# Altium project Jetson_Xavier_NX_Carrier_Board_v1.1.PrjPcb
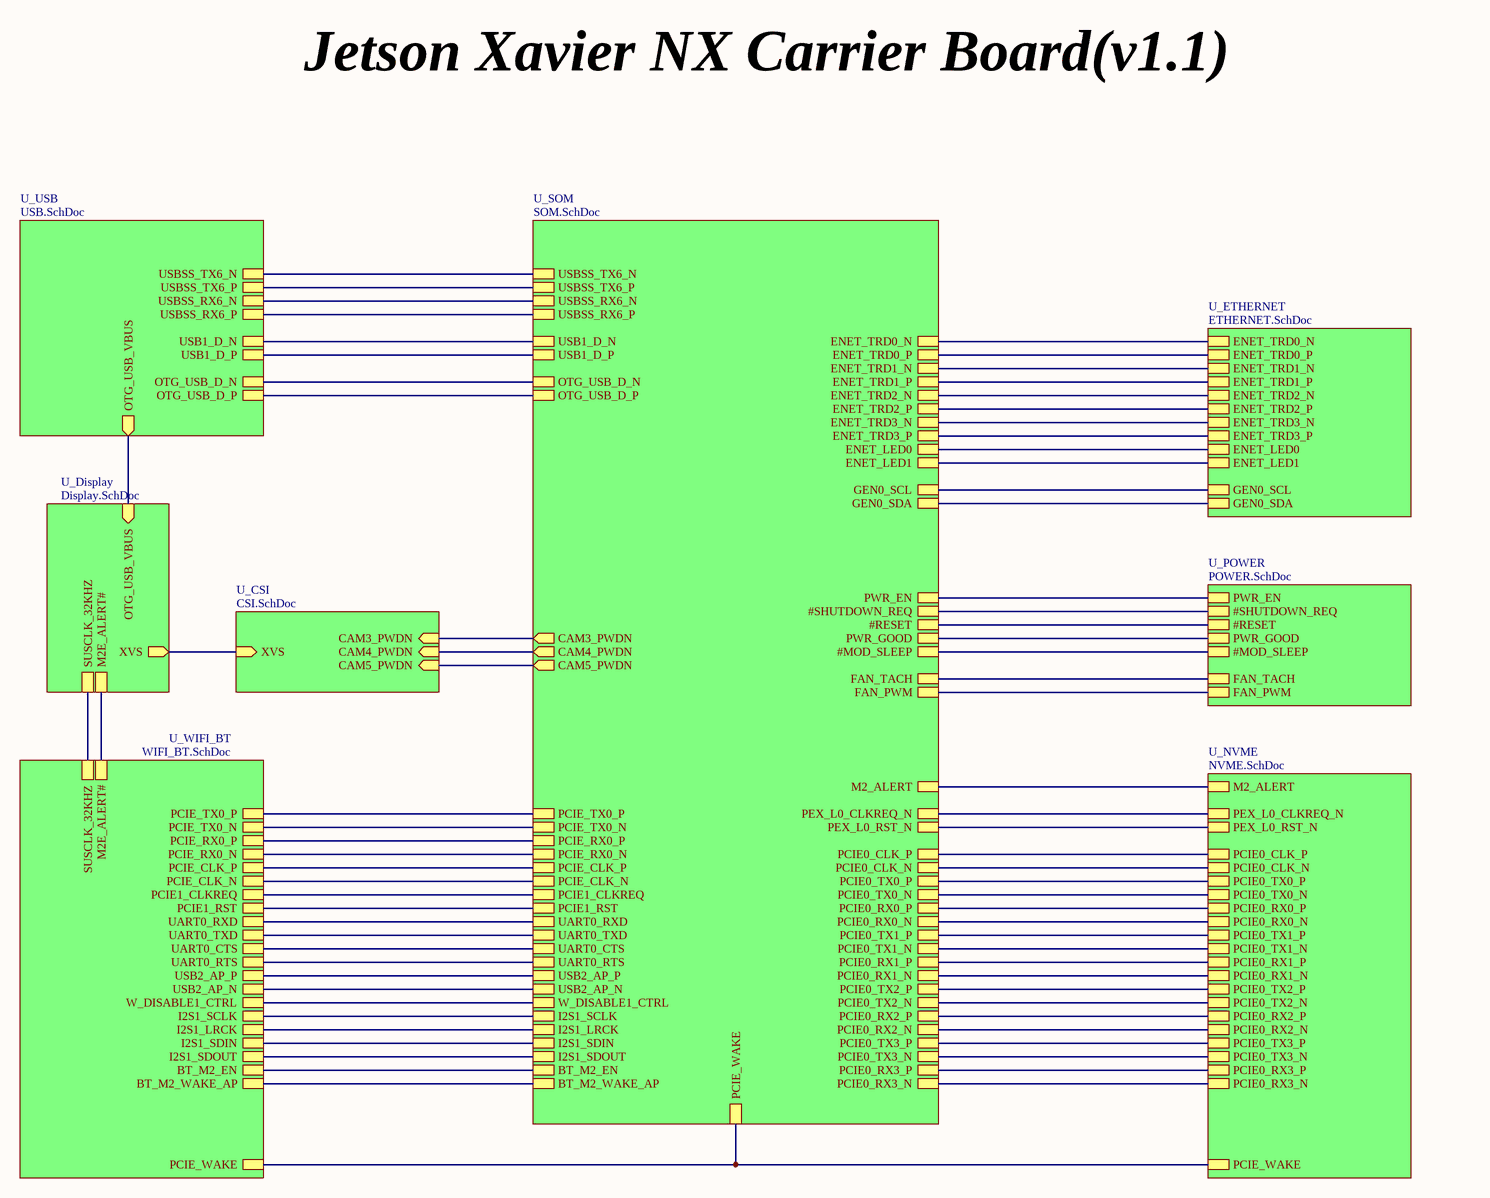
[diagram p0: Jetson_Xavier_NX_Carrier_Board_v1.1.SchDoc]
6 sheets, 156 parts. Net scope: hierarchical (ports join the sheet entries above them; power ports are global).
Board file: Xavier_NX_Carrier_Board_v1.1.PcbDoc
Sheets:
  Jetson_Xavier_NX_Carrier_Board_v1.1.SchDoc
    U_POWER = POWER.SchDoc
    U_SOM = SOM.SchDoc
    U_WIFI_BT = WIFI_BT.SchDoc
    U_NVME = NVME.SchDoc
    U_CSI = CSI.SchDoc

## Sheet Jetson_Xavier_NX_Carrier_Board_v1.1.SchDoc
size A3

### Sub-sheets
U_CSI = CSI.SchDoc: XVS (in), CAM3_PWDN (in), CAM4_PWDN (in), CAM5_PWDN (in)
U_Display = Display.SchDoc (file not in this document): OTG_USB_VBUS (in), M2E_ALERT#, SUSCLK_32KHZ, XVS (out)
U_ETHERNET = ETHERNET.SchDoc (file not in this document): ENET_LED1, ENET_TRD0_N, ENET_TRD0_P, ENET_TRD1_N, ENET_TRD1_P, ENET_TRD2_N, ENET_TRD2_P, ENET_TRD3_N, ENET_TRD3_P, ENET_LED0, GEN0_SCL, GEN0_SDA
U_NVME = NVME.SchDoc: PCIE_WAKE, PEX_L0_RST_N, PCIE0_CLK_P, PCIE0_CLK_N, PCIE0_TX0_P, PCIE0_TX0_N, PCIE0_RX0_P, PCIE0_RX0_N, PCIE0_TX1_P, PCIE0_TX1_N, PCIE0_RX1_P, PCIE0_RX1_N, PCIE0_TX2_P, PCIE0_TX2_N, PCIE0_RX2_P, PCIE0_RX2_N, PCIE0_TX3_P, PCIE0_TX3_N, PCIE0_RX3_P, PCIE0_RX3_N, PEX_L0_CLKREQ_N, M2_ALERT
U_POWER = POWER.SchDoc: PWR_EN, #SHUTDOWN_REQ, #RESET, PWR_GOOD, #MOD_SLEEP, FAN_TACH, FAN_PWM
U_SOM = SOM.SchDoc: PWR_EN, #SHUTDOWN_REQ, #RESET, PWR_GOOD, #MOD_SLEEP, GEN0_SCL, GEN0_SDA, PCIE_WAKE, PEX_L0_RST_N, PCIE0_CLK_P, PCIE0_CLK_N, PCIE0_TX0_P, PCIE0_TX0_N, PCIE0_RX0_P, PCIE0_RX0_N, PCIE0_TX1_P, PCIE0_TX1_N, PCIE0_RX1_P, PCIE0_RX1_N, PCIE0_TX2_P, PCIE0_TX2_N, PCIE0_RX2_P, PCIE0_RX2_N, PCIE0_TX3_P, PCIE0_TX3_N, PCIE0_RX3_P, PCIE0_RX3_N, USBSS_TX6_N, USBSS_TX6_P, USBSS_RX6_N, USBSS_RX6_P, ENET_TRD0_N, ENET_TRD0_P, ENET_TRD1_N, ENET_TRD1_P, ENET_TRD2_N, ENET_TRD2_P, ENET_TRD3_N, ENET_TRD3_P, ENET_LED1, ENET_LED0, PEX_L0_CLKREQ_N, M2_ALERT, PCIE1_RST, UART0_RTS, UART0_CTS, UART0_TXD, UART0_RXD, BT_M2_WAKE_AP, BT_M2_EN, W_DISABLE1_CTRL, USB2_AP_N, USB2_AP_P, USB1_D_P, USB1_D_N, OTG_USB_D_P, OTG_USB_D_N, PCIE1_CLKREQ, PCIE_CLK_N, PCIE_CLK_P, PCIE_RX0_N, PCIE_RX0_P, PCIE_TX0_N, PCIE_TX0_P, FAN_PWM, FAN_TACH, I2S1_SCLK, I2S1_LRCK, I2S1_SDIN, I2S1_SDOUT, CAM3_PWDN (out), CAM4_PWDN (out), CAM5_PWDN (out)
U_USB = USB.SchDoc (file not in this document): USBSS_TX6_N, USBSS_TX6_P, USBSS_RX6_N, USBSS_RX6_P, USB1_D_N, USB1_D_P, OTG_USB_VBUS (out), OTG_USB_D_N, OTG_USB_D_P
U_WIFI_BT = WIFI_BT.SchDoc: M2E_ALERT#, W_DISABLE1_CTRL, BT_M2_EN, SUSCLK_32KHZ, UART0_RTS, UART0_CTS, UART0_TXD, UART0_RXD, BT_M2_WAKE_AP, I2S1_SDOUT, I2S1_SDIN, I2S1_LRCK, I2S1_SCLK, USB2_AP_N, USB2_AP_P, PCIE_CLK_N, PCIE_CLK_P, PCIE_RX0_N, PCIE_RX0_P, PCIE_TX0_N, PCIE_TX0_P, PCIE_WAKE, PCIE1_CLKREQ, PCIE1_RST

### Nets
#MOD_SLEEP: sheet U_POWER/#MOD_SLEEP, sheet U_SOM/#MOD_SLEEP
#RESET: sheet U_POWER/#RESET, sheet U_SOM/#RESET
#SHUTDOWN_REQ: sheet U_POWER/#SHUTDOWN_REQ, sheet U_SOM/#SHUTDOWN_REQ
BT_M2_EN: sheet U_SOM/BT_M2_EN, sheet U_WIFI_BT/BT_M2_EN
BT_M2_WAKE_AP: sheet U_SOM/BT_M2_WAKE_AP, sheet U_WIFI_BT/BT_M2_WAKE_AP
CAM3_PWDN: sheet U_SOM/CAM3_PWDN, sheet U_CSI/CAM3_PWDN
CAM4_PWDN: sheet U_SOM/CAM4_PWDN, sheet U_CSI/CAM4_PWDN
CAM5_PWDN: sheet U_SOM/CAM5_PWDN, sheet U_CSI/CAM5_PWDN
ENET_LED0: sheet U_ETHERNET/ENET_LED0, sheet U_SOM/ENET_LED0
ENET_LED1: sheet U_ETHERNET/ENET_LED1, sheet U_SOM/ENET_LED1
ENET_TRD0_N: sheet U_ETHERNET/ENET_TRD0_N, sheet U_SOM/ENET_TRD0_N
ENET_TRD0_P: sheet U_ETHERNET/ENET_TRD0_P, sheet U_SOM/ENET_TRD0_P
ENET_TRD1_N: sheet U_ETHERNET/ENET_TRD1_N, sheet U_SOM/ENET_TRD1_N
ENET_TRD1_P: sheet U_ETHERNET/ENET_TRD1_P, sheet U_SOM/ENET_TRD1_P
ENET_TRD2_N: sheet U_ETHERNET/ENET_TRD2_N, sheet U_SOM/ENET_TRD2_N
ENET_TRD2_P: sheet U_ETHERNET/ENET_TRD2_P, sheet U_SOM/ENET_TRD2_P
ENET_TRD3_N: sheet U_ETHERNET/ENET_TRD3_N, sheet U_SOM/ENET_TRD3_N
ENET_TRD3_P: sheet U_ETHERNET/ENET_TRD3_P, sheet U_SOM/ENET_TRD3_P
FAN_PWM: sheet U_POWER/FAN_PWM, sheet U_SOM/FAN_PWM
FAN_TACH: sheet U_POWER/FAN_TACH, sheet U_SOM/FAN_TACH
GEN0_SCL: sheet U_ETHERNET/GEN0_SCL, sheet U_SOM/GEN0_SCL
GEN0_SDA: sheet U_ETHERNET/GEN0_SDA, sheet U_SOM/GEN0_SDA
I2S1_LRCK: sheet U_SOM/I2S1_LRCK, sheet U_WIFI_BT/I2S1_LRCK
I2S1_SCLK: sheet U_SOM/I2S1_SCLK, sheet U_WIFI_BT/I2S1_SCLK
I2S1_SDIN: sheet U_SOM/I2S1_SDIN, sheet U_WIFI_BT/I2S1_SDIN
I2S1_SDOUT: sheet U_SOM/I2S1_SDOUT, sheet U_WIFI_BT/I2S1_SDOUT
M2_ALERT: sheet U_SOM/M2_ALERT, sheet U_NVME/M2_ALERT
M2E_ALERT#: sheet U_Display/M2E_ALERT#, sheet U_WIFI_BT/M2E_ALERT#
OTG_USB_D_N: sheet U_SOM/OTG_USB_D_N, sheet U_USB/OTG_USB_D_N
OTG_USB_D_P: sheet U_SOM/OTG_USB_D_P, sheet U_USB/OTG_USB_D_P
PCIE0_CLK_N: sheet U_SOM/PCIE0_CLK_N, sheet U_NVME/PCIE0_CLK_N
PCIE0_CLK_P: sheet U_SOM/PCIE0_CLK_P, sheet U_NVME/PCIE0_CLK_P
PCIE0_RX0_N: sheet U_SOM/PCIE0_RX0_N, sheet U_NVME/PCIE0_RX0_N
PCIE0_RX0_P: sheet U_SOM/PCIE0_RX0_P, sheet U_NVME/PCIE0_RX0_P
PCIE0_RX1_N: sheet U_SOM/PCIE0_RX1_N, sheet U_NVME/PCIE0_RX1_N
PCIE0_RX1_P: sheet U_SOM/PCIE0_RX1_P, sheet U_NVME/PCIE0_RX1_P
PCIE0_RX2_N: sheet U_SOM/PCIE0_RX2_N, sheet U_NVME/PCIE0_RX2_N
PCIE0_RX2_P: sheet U_SOM/PCIE0_RX2_P, sheet U_NVME/PCIE0_RX2_P
PCIE0_RX3_N: sheet U_SOM/PCIE0_RX3_N, sheet U_NVME/PCIE0_RX3_N
PCIE0_RX3_P: sheet U_SOM/PCIE0_RX3_P, sheet U_NVME/PCIE0_RX3_P
PCIE0_TX0_N: sheet U_SOM/PCIE0_TX0_N, sheet U_NVME/PCIE0_TX0_N
PCIE0_TX0_P: sheet U_SOM/PCIE0_TX0_P, sheet U_NVME/PCIE0_TX0_P
PCIE0_TX1_N: sheet U_SOM/PCIE0_TX1_N, sheet U_NVME/PCIE0_TX1_N
PCIE0_TX1_P: sheet U_SOM/PCIE0_TX1_P, sheet U_NVME/PCIE0_TX1_P
PCIE0_TX2_N: sheet U_SOM/PCIE0_TX2_N, sheet U_NVME/PCIE0_TX2_N
PCIE0_TX2_P: sheet U_SOM/PCIE0_TX2_P, sheet U_NVME/PCIE0_TX2_P
PCIE0_TX3_N: sheet U_SOM/PCIE0_TX3_N, sheet U_NVME/PCIE0_TX3_N
PCIE0_TX3_P: sheet U_SOM/PCIE0_TX3_P, sheet U_NVME/PCIE0_TX3_P
PCIE1_CLKREQ: sheet U_SOM/PCIE1_CLKREQ, sheet U_WIFI_BT/PCIE1_CLKREQ
PCIE1_RST: sheet U_SOM/PCIE1_RST, sheet U_WIFI_BT/PCIE1_RST
PCIE_CLK_N: sheet U_SOM/PCIE_CLK_N, sheet U_WIFI_BT/PCIE_CLK_N
PCIE_CLK_P: sheet U_SOM/PCIE_CLK_P, sheet U_WIFI_BT/PCIE_CLK_P
PCIE_RX0_N: sheet U_SOM/PCIE_RX0_N, sheet U_WIFI_BT/PCIE_RX0_N
PCIE_RX0_P: sheet U_SOM/PCIE_RX0_P, sheet U_WIFI_BT/PCIE_RX0_P
PCIE_TX0_N: sheet U_SOM/PCIE_TX0_N, sheet U_WIFI_BT/PCIE_TX0_N
PCIE_TX0_P: sheet U_SOM/PCIE_TX0_P, sheet U_WIFI_BT/PCIE_TX0_P
PCIE_WAKE: sheet U_SOM/PCIE_WAKE, sheet U_WIFI_BT/PCIE_WAKE, sheet U_NVME/PCIE_WAKE
PEX_L0_CLKREQ_N: sheet U_SOM/PEX_L0_CLKREQ_N, sheet U_NVME/PEX_L0_CLKREQ_N
PEX_L0_RST_N: sheet U_SOM/PEX_L0_RST_N, sheet U_NVME/PEX_L0_RST_N
PWR_EN: sheet U_POWER/PWR_EN, sheet U_SOM/PWR_EN
PWR_GOOD: sheet U_POWER/PWR_GOOD, sheet U_SOM/PWR_GOOD
SUSCLK_32KHZ: sheet U_Display/SUSCLK_32KHZ, sheet U_WIFI_BT/SUSCLK_32KHZ
UART0_CTS: sheet U_SOM/UART0_CTS, sheet U_WIFI_BT/UART0_CTS
UART0_RTS: sheet U_SOM/UART0_RTS, sheet U_WIFI_BT/UART0_RTS
UART0_RXD: sheet U_SOM/UART0_RXD, sheet U_WIFI_BT/UART0_RXD
UART0_TXD: sheet U_SOM/UART0_TXD, sheet U_WIFI_BT/UART0_TXD
USB1_D_N: sheet U_SOM/USB1_D_N, sheet U_USB/USB1_D_N
USB1_D_P: sheet U_SOM/USB1_D_P, sheet U_USB/USB1_D_P
USB2_AP_N: sheet U_SOM/USB2_AP_N, sheet U_WIFI_BT/USB2_AP_N
USB2_AP_P: sheet U_SOM/USB2_AP_P, sheet U_WIFI_BT/USB2_AP_P
USBSS_RX6_N: sheet U_SOM/USBSS_RX6_N, sheet U_USB/USBSS_RX6_N
USBSS_RX6_P: sheet U_SOM/USBSS_RX6_P, sheet U_USB/USBSS_RX6_P
USBSS_TX6_N: sheet U_SOM/USBSS_TX6_N, sheet U_USB/USBSS_TX6_N
USBSS_TX6_P: sheet U_SOM/USBSS_TX6_P, sheet U_USB/USBSS_TX6_P
W_DISABLE1_CTRL: sheet U_SOM/W_DISABLE1_CTRL, sheet U_WIFI_BT/W_DISABLE1_CTRL
XVS: sheet U_Display/XVS, sheet U_CSI/XVS
(unnamed): sheet U_Display/OTG_USB_VBUS, sheet U_USB/OTG_USB_VBUS

### Notes on the sheet
- Jetson Xavier NX Carrier Board(v1.1)
- Title
- Size:
- Date:
- A3
- Number:
- Time:
- Revision:
- Sheet
- of
- Go360.io

## Sheet POWER.SchDoc
size A3
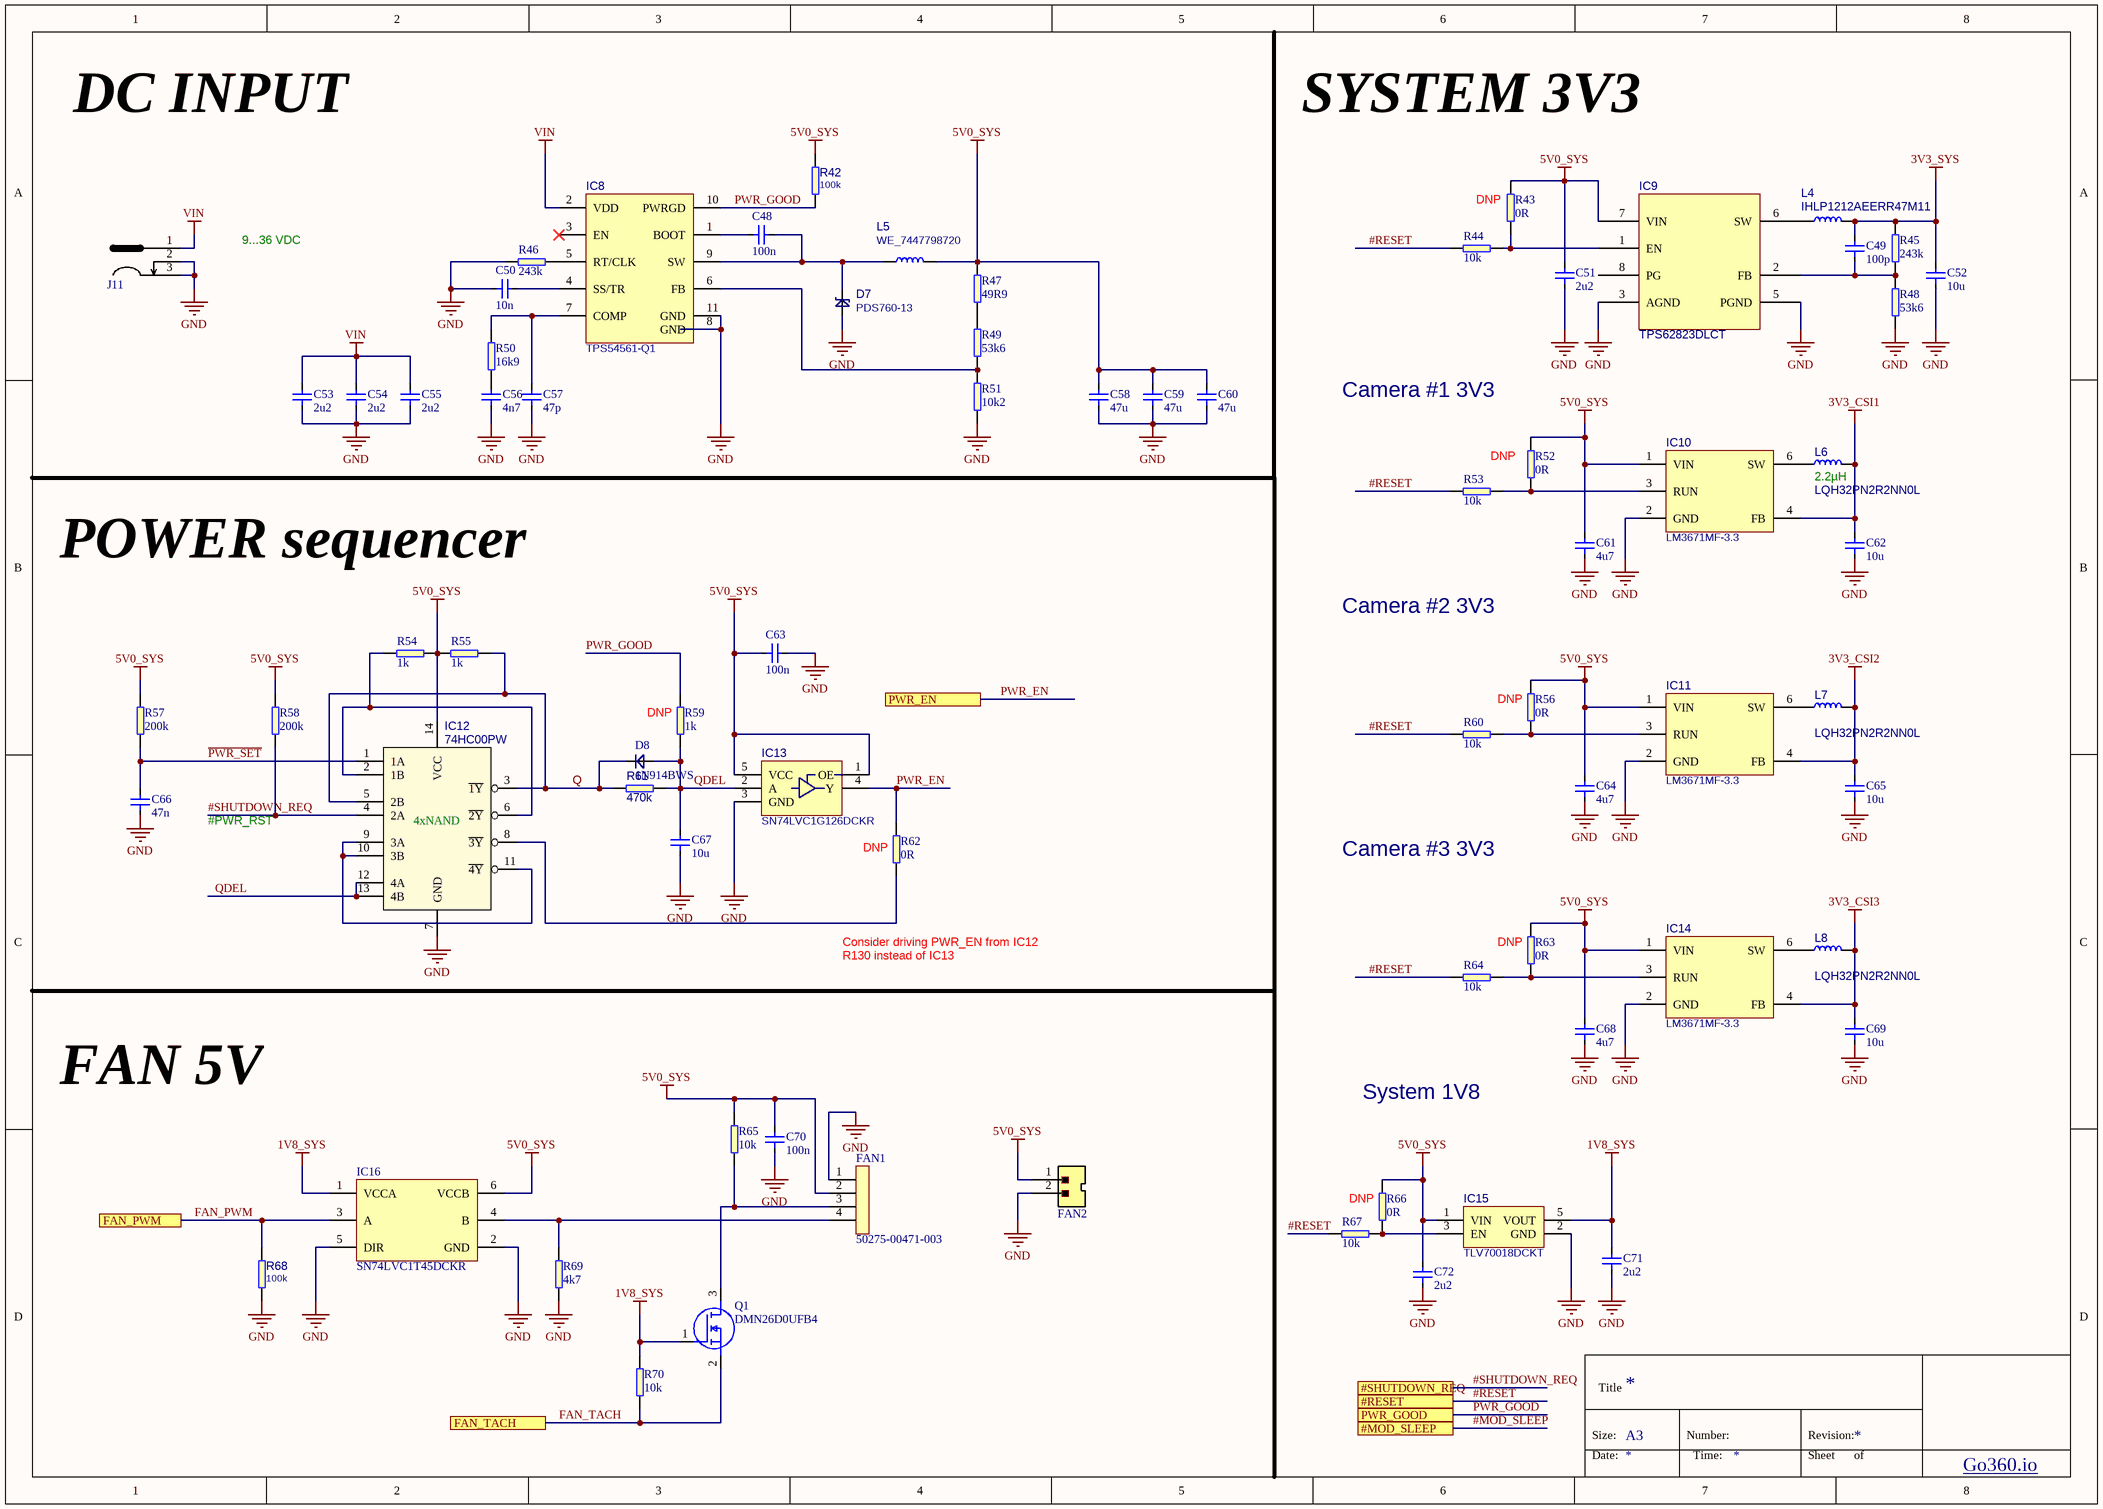
[diagram p1: POWER.SchDoc]

### Parts
C48  100n  [C0402]
C49  100p  [0805]
C50  10n  [C0402]
C51  2u2  [C0402]
C52  10u  [C0603]
C53  2u2  [1206]
C54  2u2  [1206]
C55  2u2  [1206]
C56  4n7  [C0402]
C57  47p  [C0402]
C58  47u  [0805]
C59  47u  [0805]
C60  47u  [0805]
C61  4u7  [C0402]
C62  10u  [C0603]
C63  100n  [C0402]
C64  4u7  [C0402]
C65  10u  [C0603]
C66  47n  [C0402]
C67  10u  [C0603]
C68  4u7  [C0402]
C69  10u  [C0603]
C70  100n  [C0402]
C71  2u2  [C0402]
C72  2u2  [C0402]
D7  PDS760-13  [PowerDI]
D8  1N914BWS  [SOD-323]
FAN1  50275-00471-003  [CON_MISC_004_TH_ST_M_P013_WTB]
FAN2  MX-22-23-2021  [molex_2223-2021]  (value not drawn)
IC8  TPS54561-Q1  [WSON-10_4x4]
IC9  TPS62823DLCT  [TPS62823]
IC10  LM3671MF-3.3  [SOT23-5N]
IC11  LM3671MF-3.3  [SOT23-5N]
IC12  74HC00PW  [TSSOP-14]
IC13  SN74LVC1G126DCKR  [R-PDSO-G5]
IC14  LM3671MF-3.3  [SOT23-5N]
IC15  TLV70018DCKT  [SC70-5]
IC16  SN74LVC1T45DCKR  [SC70_6]
J11  DC-005-5A-2.5  [DC_SOCKET]  (value not drawn)
L4  IHLP1212AEERR47M11  [IHLP-1212AE]
L5  WE_7447798720  [WE_7447798720]
L6  LQH32PN2R2NN0L  [LQH32PN2R2NN0L]
L7  LQH32PN2R2NN0L  [LQH32PN2R2NN0L]
L8  LQH32PN2R2NN0L  [LQH32PN2R2NN0L]
Q1  DMN26D0UFB4  [DMN26D0UFB47]
R42  100k  [R0402]
R43  0R  [R0402]
R44  10k  [R0402]
R45  243k  [R0402]
R46  243k  [R0402]
R47  49R9  [R0402]
R48  53k6  [R0402]
R49  53k6  [R0402]
R50  16k9  [R0402]
R51  10k2  [R0402]
R52  0R  [R0402]
R53  10k  [R0402]
R54  1k  [R0402]
R55  1k  [R0402]
R56  0R  [R0402]
R57  200k  [R0402]
R58  200k  [R0402]
R59  1k  [R0402]
R60  10k  [R0402]
R61  470k  [R0402]
R62  0R  [R0402]
R63  0R  [R0402]
R64  10k  [R0402]
R65  10k  [R0402]
R66  0R  [R0402]
R67  10k  [R0402]
R68  100k  [R0402]
R69  4k7  [R0402]
R70  10k  [R0402]

### Ports
#MOD_SLEEP, #RESET, #SHUTDOWN_REQ, FAN_PWM, FAN_TACH, PWR_EN, PWR_GOOD

### Nets
1V8_SYS: C71.2 IC15.5(VOUT) IC16.1(VCCA) Q1.1(G) R70.2
3V3_CSI1: C62.2 IC10.4(FB) L6.2
3V3_CSI2: C65.2 IC11.4(FB) L7.2
3V3_CSI3: C69.2 IC14.4(FB) L8.2
3V3_SYS: C49.2 C52.2 L4.2 R45.2
5V0_SYS: C51.2 C58.2 C59.2 C60.2 C61.2 C63.1 C64.2 C68.2 C70.2 C72.2 FAN1.2 FAN2.1 IC9.7(VIN) IC10.1(VIN) IC11.1(VIN) IC12.14(VCC) IC13.1(OE) IC13.5(VCC) IC14.1(VIN) IC15.1(VIN) IC16.6(VCCB) L5.2 R42.1 R43.2 R47.2 R52.2 R54.2 R55.1 R56.2 R57.2 R58.2 R63.2 R65.2 R66.2
GND: C50.1 C51.1 C52.1 C53.1 C54.1 C55.1 C56.1 C57.1 C58.1 C59.1 C60.1 C61.1 C62.1 C63.2 C64.1 C65.1 C66.1 C67.1 C68.1 C69.1 C70.1 C71.1 C72.1 D7.A FAN1.1 FAN2.2 IC8.8(GND) IC8.11(GND) IC9.3(AGND) IC9.5(PGND) IC10.2(GND) IC11.2(GND) IC12.7(GND) IC13.3(GND) IC14.2(GND) IC15.2(GND) IC16.2(GND) IC16.5(DIR) J11.2 J11.3 R46.1 R48.1 R51.1 R68.2 R69.1
VIN: C53.2 C54.2 C55.2 IC8.2(VDD) J11.1
#MOD_SLEEP: port #MOD_SLEEP
#RESET: R44.1 R53.1 R60.1 R64.1 R67.1 ; port #RESET
#SHUTDOWN_REQ: IC12.4(2A) R58.1 ; port #SHUTDOWN_REQ
~{PWR_SET}: C66.2 IC12.1(1A) R57.1
FAN_PWM: IC16.3(A) R68.1 ; port FAN_PWM
FAN_TACH: Q1.2(S) R70.1 ; port FAN_TACH
PWR_EN: IC13.4(Y) R62.2 ; port PWR_EN
PWR_GOOD: IC8.10(PWRGD) R42.2 R59.2 ; port PWR_GOOD
Q: D8.C IC12.3(~{1Y}) IC12.5(2B) R55.2 R61.1
QDEL: C67.2 D8.A IC12.12(4A) IC12.13(4B) IC13.2(A) R59.1 R61.2
NetC48_1: C48.1 IC8.1(BOOT)
NetC48_2: C48.2 D7.C IC8.9(SW) L5.1
NetC49_1: C49.1 IC9.2(FB) R45.1 R48.2
NetC50_2: C50.2 IC8.4(SS/TR)
NetC56_2: C56.2 R50.1
NetC57_2: C57.2 IC8.7(COMP) R50.2
NetFAN1_3: FAN1.3 Q1.3(D) R65.1
NetFAN1_4: FAN1.4 IC16.4(B) R69.2
NetIC8_5: IC8.5(RT/CLK) R46.2
NetIC8_6: IC8.6(FB) R49.1 R51.2
NetIC9_1: IC9.1(EN) R43.1 R44.2
NetIC9_6: IC9.6(SW) L4.1
NetIC10_3: IC10.3(RUN) R52.1 R53.2
NetIC10_6: IC10.6(SW) L6.1
NetIC11_3: IC11.3(RUN) R56.1 R60.2
NetIC11_6: IC11.6(SW) L7.1
NetIC12_2: IC12.2(1B) IC12.6(~{2Y}) R54.1
NetIC12_8: IC12.8(~{3Y}) R62.1
NetIC12_9: IC12.9(3A) IC12.10(3B) IC12.11(~{4Y})
NetIC14_3: IC14.3(RUN) R63.1 R64.2
NetIC14_6: IC14.6(SW) L8.1
NetIC15_3: IC15.3(EN) R66.1 R67.2
NetR47_1: R47.1 R49.2

Not connected (* = marked no-connect by the designer): IC8 3(EN)*; IC9 8(PG)

### Notes on the sheet
- DC INPUT
- SYSTEM 3V3
- 9...36 VDC
- (near R43) DNP
- Camera #1 3V3
- DNP
- (near L6) 2.2µH
- POWER sequencer
- Camera #2 3V3
- (near R59) DNP
- (near R56) DNP
- #PWR_RST
- (near R62) DNP
- Camera #3 3V3
- R130 instead of IC13
- Consider driving PWR_EN from IC12
- (near R63) DNP
- FAN 5V
- System 1V8
- Title
- Size:
- Date:
- A3
- Number:
- Time:
- Revision:
- Sheet
- of
- Go360.io
- (in symbol 74HC00PW) 4xNAND

### Library data of the parts
C48 C63 C70 = C_100n_0402: MLCC SMT Capacitor 100n 0402; Manufacturer: TDK; PartSymbol: C1005X5R0J104K050BA; PartNumber: C_100n_0402; Value: 100n
C49 = C_47u_0805: MLCC SMT Capacitor 100pF 0805; PartNumber: C_100p_0805; PartSymbol: 08051A101JAT2A; Value: 100p
C50 = C_10n_0402: MLCC SMT Capacitor 10 nF 0402; Manufacturer: AVX; PartSymbol: 04025G103ZAT2A; PartNumber: C_10n_0402; Value: 10n
C51 C71 C72 = C_2u2_0402: MLCC SMT Capacitor 2.2uF 0402; Manufacturer: TDK; PartSymbol: C1005X5R1A225K050BC; PartNumber: C_2u2_0402; Value: 2u2
C52 C62 C65 C67 C69 = C_10u_0603: MLCC SMT Capacitor 10uF 0603; Manufacturer: Walsin; PartSymbol: 0603X106M6R3CT; PartNumber: C_10u_0603; Value: 10u
C53-C55 = C_2u2_1206: MLCC SMT Capacitor 2.2uF 1206; Manufacturer: KEMET; PartSymbol: C1206C225J5RACTU; PartNumber: C_2u2_1206; Value: 2u2
C56 = C_4n7_0402: MLCC SMT Capacitor 4.7 nF 0402; Manufacturer: TDK; PartSymbol: CGA2B3X7S2A472K050BB; PartNumber: C_4n7_0402; Value: 4n7
C57 = C_47p_0402: MLCC SMT Capacitor 47pF 0402; Manufacturer: KEMET; PartSymbol: C0402C470J5GACTU; PartNumber: C_47p_0402; Value: 47p
C58-C60 = C_47u_0805: MLCC SMT Capacitor 47uF 0805; Manufacturer: KEMET; PartSymbol: C0805C476M9PACTU; PartNumber: C_47u_0805; Value: 47u
C61 C64 C68 = C_4u7_0402: MLCC SMT Capacitor 4.7uF 0402; Manufacturer: MURATA; PartSymbol: GRM155R60G475ME; PartNumber: C_4u7_0402; Value: 4u7
C66 = C_47n_0402: MLCC SMT Capacitor 47nF 0402; Manufacturer: MULTICOMP; PartSymbol: MC0402X473K160CT; PartNumber: C_47n_0402; Value: 47n
D7 = Diode Schottky: DIODE SCHOTTKY 60V 7A POWERDI5; Manufacturer: DIODES INC.; PartNumber: PDS760-13; Value: PDS760-13; PartSymbol: PDS760-13
D8 = diode: Diode small signal; Manufacturer: ON SEMICONDUCTOR; PartNumber: 1N914BWS; Value: 1N914BWS; PartSymbol: 1N914BWS
FAN2 = molex_2223-2021: Pinhead connector with key; Manufacturer: Molex; PartSymbol: 022232021 A-6373-02A222; Value: MX-22-23-2021; PartNumber: molex_2223-2021
IC8 = TPS54561: IC REG BCK SPLIT RAIL ADJ 10WSON; Manufacturer: TEXAS INSTRUMENTS; PartNumber: TPS54561-Q1; Value: TPS54561-Q1; PartSymbol: TPS54561-Q1
IC9 = TPS62823: IC REG BUCK ADJ 1A 8VSON-HR; Manufacturer: TEXAS INSTRUMENTS; PartNumber: TPS62823; Value: TPS62823DLCT; PartSymbol: TPS62823DLCT; Class: IC
IC10 IC11 IC14 = LM3671: DC/DC Buck Converter; Manufacturer: TEXAS INSTRUMENTS; PartSymbol: LM3671MF-3.3/NOPB; Value: LM3671MF-3.3; PartNumber: LM3671MF-3.3
IC12 = 74HC00PW: 2 NAND Gate, 4 channel; Manufacturer: NEXPERIA; PartNumber: 74HC00PW; Value: 74HC00PW; PartSymbol: 74HC00PW
IC13 = SN74LVC1G126: Buffer, tri-state; Manufacturer: Texas Instruments; PartNumber: SN74LVC1G126DCKR; Value: SN74LVC1G126DCKR; PartSymbol: SN74LVC1G126DCKR
IC15 = TLV700: Voltage Regulator, 2V to 5.5V, 175mV Dropout, 1.8Vout, 200mAout; Manufacturer: TEXAS INSTRUMENTS; Value: TLV70018DCKT; PartNumber: TLV70018DCKT; PartSymbol: TLV70018DCKT
J11 = DC_SOCKET: DC Power Connector, Jack, 4 A, 1.95 mm, PCB Mount, Through Hole; Manufacturer: XKB Connectivity; PartNumber: DC-005-5A-2.5; PartSymbol: DC-005-5A-2.5; Value: DC-005-5A-2.5
L4 = IHLP1212AEERR47M11: FIXED IND 470NH 6.7A 15 MOHM SMD; Manufacturer: VISHAY; Class: Inductance; PartNumber: IHLP1212AEERR47M11; Value: IHLP1212AEERR47M11; PartSymbol: IHLP1212AEERR47M11; Inductance: 470nH; RatedCurrent: 6.7A
L5 = WE_7447798720: Fixed Inductors WE-PDF 1064 7.2uH 7.9A 12.8mOhm; Manufacturer: WURTH ELEKTRONIK; PartNumber: WE_7447798720; Value: WE_7447798720; PartSymbol: 7447798720; Inductance: 7.2uH; RatedCurrent: 7.9A
L6-L8 = LQH32PN2R2NN0L: INDUCTOR, 2.2 ?H, ? 30%, 1212, 90 MHz, 0.073 ohm; Manufacturer: MURATA; Inductance: 2.2uH; PartNumber: LQH32PN2R2NN0L; Value: LQH32PN2R2NN0L; PartSymbol: LQH32PN2R2NN0L
Q1 = DMN26D0UFB4: MOSFET (N-Channel); Manufacturer_Name: Diodes Inc.; Manufacturer_Part_Number: DMN26D0UFB4-7; Datasheet Link: https://componentsearchengine.com/Datasheets/1/DMN26D0UFB4-7.pdf; Height: 0.4mm; Arrow Part Number: DMN26D0UFB4-7; Arrow Price/Stock: https://www.arrow.com/en/products/dmn26d0ufb4-7/diodes-incorporated; Mouser Part Number: 621-DMN26D0UFB4-7; Mouser Price/Stock: https://www.mouser.co.uk/ProductDetail/Diodes-Incorporated/DMN26D0UFB4-7?qs=GWgl%252BsiMZr%252B4pznsTuF3iQ%3D%3D
R42 R68 = R_100k_0402: SMT Resistor 100k 0402; Manufacturer: VISHAY; PartSymbol: CRCW0402100KFKEDHP; Tolerance: 1%; PartNumber: R_100k_0402; Value: 100k
R43 R52 R56 R62 R63 R66 = R_0R_0402: RES, 0R, 0402; Manufacturer: Panasonic; PartSymbol: ERJ2GE0R00X; PartNumber: R_0R_0402; Value: 0R
R44 R53 R60 R64 R65 R67 R70 = R_10k_0402: RES, 10k, 0402; Manufacturer: MULTICOMP; PartSymbol: MCMR04X1002FTL; PartNumber: R_10k_0402; Value: 10k
R45 R46 = R_243k_0402: RES, 243k, 0402; Manufacturer: MULTICOMP; PartSymbol: MCMR04X2433FTL; PartNumber: R_243k_0402; Value: 243k
R47 = R_49R9_0402: RES, 49R9, 0402; Manufacturer: VISHAY; PartSymbol: CRCW040249R9FKED; PartNumber: R_49R9_0402; Value: 49R9
R48 R49 = R_53k6_0402: RES, 53k6, 0402; Manufacturer: TE CONECTIVITY; PartSymbol: CPF0402B53K6E1; PartNumber: R_53k6_0402; Value: 53k6
R50 = R_16k9_0402: RES, 16k9, 0402; Manufacturer: Panasonic; PartSymbol: ERA2AEB1692X; PartNumber: R_16k9_0402; Value: 16k9
R51 = R_10k2_0402: RES, 10k2, 0402, 0.1%; PartNumber: R_10k2_0402_0.1%; Manufacturer: TE CONECTIVITY; PartSymbol: CPF0402B10K2E1; Tolerance: 0.1%; Value: 10k2
R54 R55 R59 = R_1k_0402: RES, 1k, 0402; Manufacturer: BOURNS; PartSymbol: CR0402-FX-1001GLF; PartNumber: R_1k_0402; Value: 1k
R57 R58 = R_200k_0402: RES, 200k, 0402; Manufacturer: YAGEO; PartSymbol: RC0402FR-07200KL; PartNumber: R_200k_0402; Value: 200k
R61 = R_470k_0402: SMT Resistor 470k 0402; Manufacturer: VISHAY; PartSymbol: CRCW0402470KFKED; PartNumber: R_470k_0402; Value: 470k
R69 = R_4k7_0402: RES, 4k7, 0402; Manufacturer: Panasonic; PartSymbol: ERJ2GEJ472X; PartNumber: R_4k7_0402; Value: 4k7

## Sheet SOM.SchDoc
size A3
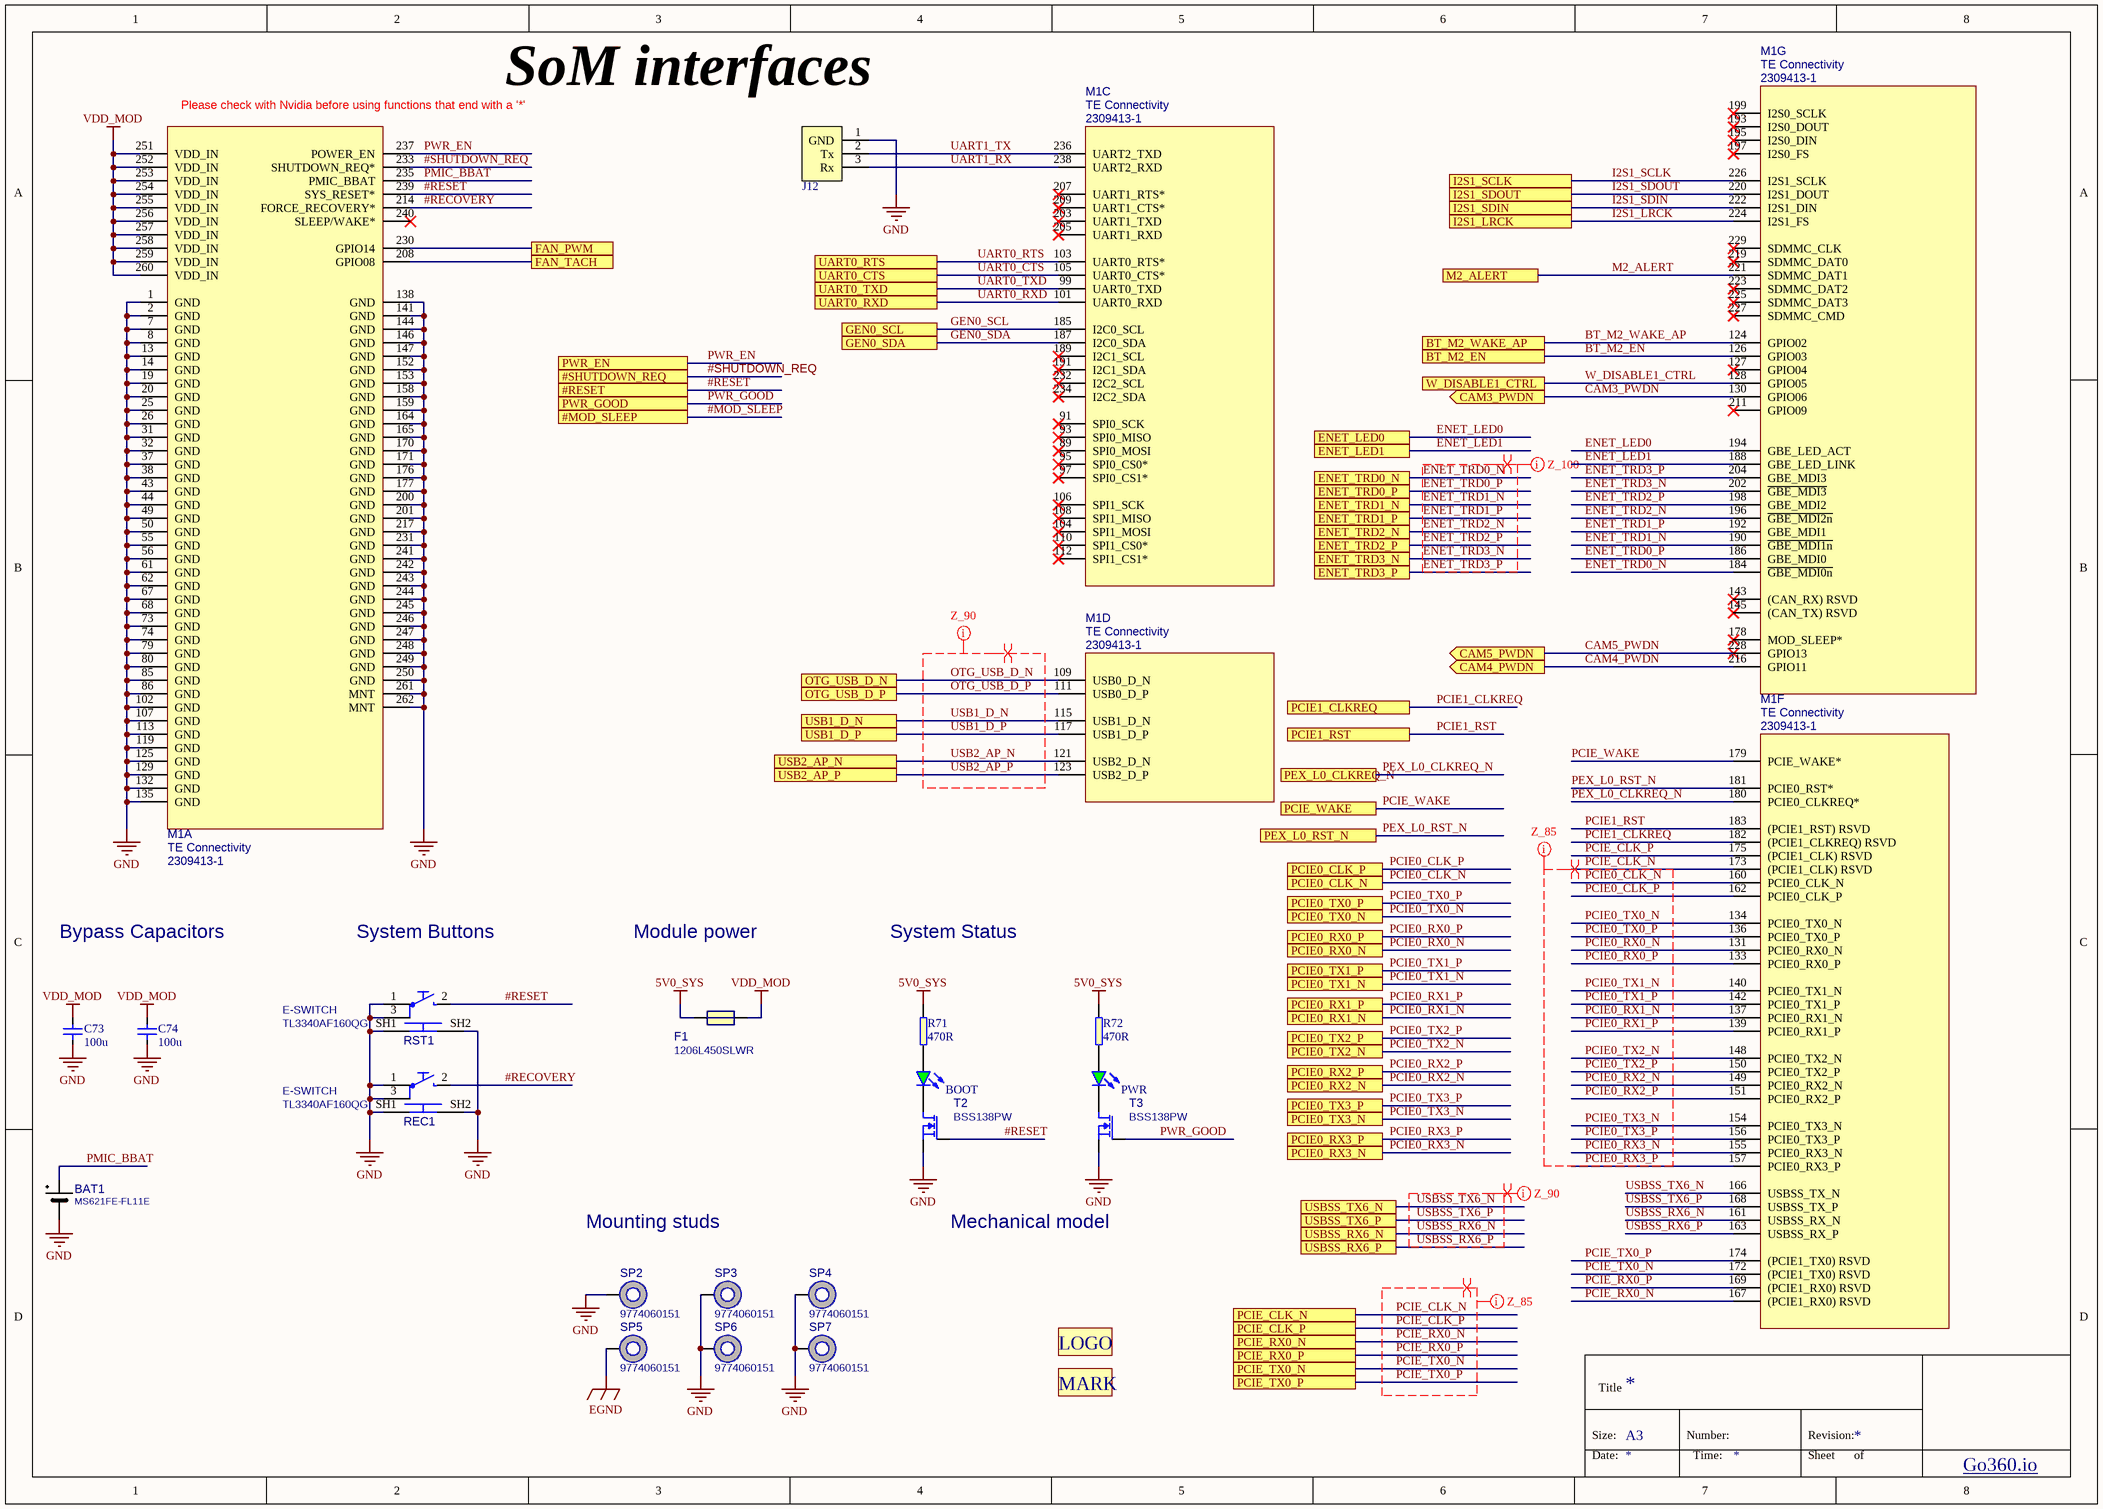
[diagram p2: SOM.SchDoc]

### Parts
BAT1  MS621FE-FL11E  [MS621FE-FL11E]
BOOT  SML-310MTT86  [LED0603]  (value not drawn)
C73  100u  [1206]
C74  100u  [1206]
F1  PartSymbol: 1206L450SLWR  [Fuse-1206]  (hidden comment: Value)
J12  HEADER_3  [826936-3]  (value not drawn)
LOGO1  LOGO  [LOGO_2]  (value not drawn)
M1  Manufacturer: TE Connectivity  [jetson-nano-connector]  (hidden comment: 2309413-1)  (parts A,C,D,F,G of 7)
MARK1  MARK  [MARK]  (value not drawn)
PWR  SML-310MTT86  [LED0603]  (value not drawn)
R71  470R  [R0402]
R72  470R  [R0402]
REC1  Manufacturer: E-SWITCH  [TL3340AF160QG]  (hidden comment: TL3340AF160QG)
RST1  Manufacturer: E-SWITCH  [TL3340AF160QG]  (hidden comment: TL3340AF160QG)
SP2  9774060151  [M2.5-6mm]
SP3  9774060151  [M2.5-6mm]
SP4  9774060151  [M2.5-6mm]
SP5  9774060151  [M2.5-6mm]
SP6  9774060151  [M2.5-6mm]
SP7  9774060151  [M2.5-6mm]
T2  BSS138PW  [SC70-3]
T3  BSS138PW  [SC70-3]

### Ports
#MOD_SLEEP, #RESET, #SHUTDOWN_REQ, BT_M2_EN, BT_M2_WAKE_AP, CAM3_PWDN (out), CAM4_PWDN (out), CAM5_PWDN (out), ENET_LED0, ENET_LED1, ENET_TRD0_N, ENET_TRD0_P, ENET_TRD1_N, ENET_TRD1_P, ENET_TRD2_N, ENET_TRD2_P, ENET_TRD3_N, ENET_TRD3_P, FAN_PWM, FAN_TACH, GEN0_SCL, GEN0_SDA, I2S1_LRCK, I2S1_SCLK, I2S1_SDIN, I2S1_SDOUT, M2_ALERT, OTG_USB_D_N, OTG_USB_D_P, PCIE0_CLK_N, PCIE0_CLK_P, PCIE0_RX0_N, PCIE0_RX0_P, PCIE0_RX1_N, PCIE0_RX1_P, PCIE0_RX2_N, PCIE0_RX2_P, PCIE0_RX3_N, PCIE0_RX3_P, PCIE0_TX0_N, PCIE0_TX0_P, PCIE0_TX1_N, PCIE0_TX1_P, PCIE0_TX2_N, PCIE0_TX2_P, PCIE0_TX3_N, PCIE0_TX3_P, PCIE1_CLKREQ, PCIE1_RST, PCIE_CLK_N, PCIE_CLK_P, PCIE_RX0_N, PCIE_RX0_P, PCIE_TX0_N, PCIE_TX0_P, PCIE_WAKE, PEX_L0_CLKREQ_N, PEX_L0_RST_N, PWR_EN, PWR_GOOD, UART0_CTS, UART0_RTS, UART0_RXD, UART0_TXD, USB1_D_N, USB1_D_P, USB2_AP_N, USB2_AP_P, USBSS_RX6_N, USBSS_RX6_P, USBSS_TX6_N, USBSS_TX6_P, W_DISABLE1_CTRL

### Nets
5V0_SYS: F1.1 R71.2 R72.2
EGND: SP5.1
GND: BAT1.- C73.1 C74.1 J12.1(GND) M1.1(GND) M1.2(GND) M1.7(GND) M1.8(GND) M1.13(GND) M1.14(GND) M1.19(GND) M1.20(GND) M1.25(GND) M1.26(GND) M1.31(GND) M1.32(GND) M1.37(GND) M1.38(GND) M1.43(GND) M1.44(GND) M1.49(GND) M1.50(GND) M1.55(GND) M1.56(GND) M1.61(GND) M1.62(GND) M1.67(GND) M1.68(GND) M1.73(GND) M1.74(GND) M1.79(GND) M1.80(GND) M1.85(GND) M1.86(GND) M1.102(GND) M1.107(GND) M1.113(GND) M1.119(GND) M1.125(GND) M1.129(GND) M1.132(GND) M1.135(GND) M1.138(GND) M1.141(GND) M1.144(GND) M1.146(GND) M1.147(GND) M1.152(GND) M1.153(GND) M1.158(GND) M1.159(GND) M1.164(GND) M1.165(GND) M1.170(GND) M1.171(GND) M1.176(GND) M1.177(GND) M1.200(GND) M1.201(GND) M1.217(GND) M1.231(GND) M1.241(GND) M1.242(GND) M1.243(GND) M1.244(GND) M1.245(GND) M1.246(GND) M1.247(GND) M1.248(GND) M1.249(GND) M1.250(GND) M1.261(MNT) M1.262(MNT) REC1.1 REC1.3 REC1.SH1 REC1.SH2 RST1.1 RST1.3 RST1.SH1 RST1.SH2 SP2.1 SP3.1 SP4.1 SP6.1 SP7.1 T2.2(S) T3.2(S)
VDD_MOD: C73.2 C74.2 F1.2 M1.251(VDD_IN) M1.252(VDD_IN) M1.253(VDD_IN) M1.254(VDD_IN) M1.255(VDD_IN) M1.256(VDD_IN) M1.257(VDD_IN) M1.258(VDD_IN) M1.259(VDD_IN) M1.260(VDD_IN)
#MOD_SLEEP: port #MOD_SLEEP
#RECOVERY: M1.214(FORCE_RECOVERY*) REC1.2
#RESET: M1.239(SYS_RESET*) RST1.2 T2.1(G) ; port #RESET
#SHUTDOWN_REQ: M1.233(SHUTDOWN_REQ*) ; port #SHUTDOWN_REQ
BT_M2_EN: M1.126(GPIO03) ; port BT_M2_EN
BT_M2_WAKE_AP: M1.124(GPIO02) ; port BT_M2_WAKE_AP
CAM3_PWDN: M1.130(GPIO06) ; port CAM3_PWDN
CAM4_PWDN: M1.216(GPIO11) ; port CAM4_PWDN
CAM5_PWDN: M1.228(GPIO13) ; port CAM5_PWDN
ENET_LED0: M1.194(GBE_LED_ACT) ; port ENET_LED0
ENET_LED1: M1.188(GBE_LED_LINK) ; port ENET_LED1
ENET_TRD0_N: M1.184(~{GBE_MDI0n}) ; port ENET_TRD0_N
ENET_TRD0_P: M1.186(GBE_MDI0) ; port ENET_TRD0_P
ENET_TRD1_N: M1.190(~{GBE_MDI1n}) ; port ENET_TRD1_N
ENET_TRD1_P: M1.192(GBE_MDI1) ; port ENET_TRD1_P
ENET_TRD2_N: M1.196(~{GBE_MDI2n}) ; port ENET_TRD2_N
ENET_TRD2_P: M1.198(GBE_MDI2) ; port ENET_TRD2_P
ENET_TRD3_N: M1.202(~{GBE_MDI3}) ; port ENET_TRD3_N
ENET_TRD3_P: M1.204(GBE_MDI3) ; port ENET_TRD3_P
FAN_PWM: M1.230(GPIO14) ; port FAN_PWM
FAN_TACH: M1.208(GPIO08) ; port FAN_TACH
GEN0_SCL: M1.185(I2C0_SCL) ; port GEN0_SCL
GEN0_SDA: M1.187(I2C0_SDA) ; port GEN0_SDA
I2S1_LRCK: M1.224(I2S1_FS) ; port I2S1_LRCK
I2S1_SCLK: M1.226(I2S1_SCLK) ; port I2S1_SCLK
I2S1_SDIN: M1.222(I2S1_DIN) ; port I2S1_SDIN
I2S1_SDOUT: M1.220(I2S1_DOUT) ; port I2S1_SDOUT
M2_ALERT: M1.221(SDMMC_DAT1) ; port M2_ALERT
OTG_USB_D_N: M1.109(USB0_D_N) ; port OTG_USB_D_N
OTG_USB_D_P: M1.111(USB0_D_P) ; port OTG_USB_D_P
PCIE0_CLK_N: M1.160(PCIE0_CLK_N) ; port PCIE0_CLK_N
PCIE0_CLK_P: M1.162(PCIE0_CLK_P) ; port PCIE0_CLK_P
PCIE0_RX0_N: M1.131(PCIE0_RX0_N) ; port PCIE0_RX0_N
PCIE0_RX0_P: M1.133(PCIE0_RX0_P) ; port PCIE0_RX0_P
PCIE0_RX1_N: M1.137(PCIE0_RX1_N) ; port PCIE0_RX1_N
PCIE0_RX1_P: M1.139(PCIE0_RX1_P) ; port PCIE0_RX1_P
PCIE0_RX2_N: M1.149(PCIE0_RX2_N) ; port PCIE0_RX2_N
PCIE0_RX2_P: M1.151(PCIE0_RX2_P) ; port PCIE0_RX2_P
PCIE0_RX3_N: M1.155(PCIE0_RX3_N) ; port PCIE0_RX3_N
PCIE0_RX3_P: M1.157(PCIE0_RX3_P) ; port PCIE0_RX3_P
PCIE0_TX0_N: M1.134(PCIE0_TX0_N) ; port PCIE0_TX0_N
PCIE0_TX0_P: M1.136(PCIE0_TX0_P) ; port PCIE0_TX0_P
PCIE0_TX1_N: M1.140(PCIE0_TX1_N) ; port PCIE0_TX1_N
PCIE0_TX1_P: M1.142(PCIE0_TX1_P) ; port PCIE0_TX1_P
PCIE0_TX2_N: M1.148(PCIE0_TX2_N) ; port PCIE0_TX2_N
PCIE0_TX2_P: M1.150(PCIE0_TX2_P) ; port PCIE0_TX2_P
PCIE0_TX3_N: M1.154(PCIE0_TX3_N) ; port PCIE0_TX3_N
PCIE0_TX3_P: M1.156(PCIE0_TX3_P) ; port PCIE0_TX3_P
PCIE1_CLKREQ: M1.182((PCIE1_CLKREQ)_RSVD) ; port PCIE1_CLKREQ
PCIE1_RST: M1.183((PCIE1_RST)_RSVD) ; port PCIE1_RST
PCIE_CLK_N: M1.173((PCIE1_CLK)_RSVD) ; port PCIE_CLK_N
PCIE_CLK_P: M1.175((PCIE1_CLK)_RSVD) ; port PCIE_CLK_P
PCIE_RX0_N: M1.167((PCIE1_RX0)_RSVD) ; port PCIE_RX0_N
PCIE_RX0_P: M1.169((PCIE1_RX0)_RSVD) ; port PCIE_RX0_P
PCIE_TX0_N: M1.172((PCIE1_TX0)_RSVD) ; port PCIE_TX0_N
PCIE_TX0_P: M1.174((PCIE1_TX0)_RSVD) ; port PCIE_TX0_P
PCIE_WAKE: M1.179(PCIE_WAKE*) ; port PCIE_WAKE
PEX_L0_CLKREQ_N: M1.180(PCIE0_CLKREQ*) ; port PEX_L0_CLKREQ_N
PEX_L0_RST_N: M1.181(PCIE0_RST*) ; port PEX_L0_RST_N
PMIC_BBAT: BAT1.+ M1.235(PMIC_BBAT)
PWR_EN: M1.237(POWER_EN) ; port PWR_EN
PWR_GOOD: T3.1(G) ; port PWR_GOOD
UART0_CTS: M1.105(UART0_CTS*) ; port UART0_CTS
UART0_RTS: M1.103(UART0_RTS*) ; port UART0_RTS
UART0_RXD: M1.101(UART0_RXD) ; port UART0_RXD
UART0_TXD: M1.99(UART0_TXD) ; port UART0_TXD
UART1_RX: J12.3(Rx) M1.238(UART2_RXD)
UART1_TX: J12.2(Tx) M1.236(UART2_TXD)
USB1_D_N: M1.115(USB1_D_N) ; port USB1_D_N
USB1_D_P: M1.117(USB1_D_P) ; port USB1_D_P
USB2_AP_N: M1.121(USB2_D_N) ; port USB2_AP_N
USB2_AP_P: M1.123(USB2_D_P) ; port USB2_AP_P
USBSS_RX6_N: M1.161(USBSS_RX_N) ; port USBSS_RX6_N
USBSS_RX6_P: M1.163(USBSS_RX_P) ; port USBSS_RX6_P
USBSS_TX6_N: M1.166(USBSS_TX_N) ; port USBSS_TX6_N
USBSS_TX6_P: M1.168(USBSS_TX_P) ; port USBSS_TX6_P
W_DISABLE1_CTRL: M1.128(GPIO05) ; port W_DISABLE1_CTRL
NetBOOT_A: BOOT.A R71.1
NetBOOT_K: BOOT.K T2.3(D)
NetPWR_A: PWR.A R72.1
NetPWR_K: PWR.K T3.3(D)

Not connected (* = marked no-connect by the designer): M1 89(SPI0_MOSI)* 91(SPI0_SCK)* 93(SPI0_MISO)* 95(SPI0_CS0*)* 97(SPI0_CS1*)* 104(SPI1_MOSI)* 106(SPI1_SCK)* 108(SPI1_MISO)* 110(SPI1_CS0*)* 112(SPI1_CS1*)* 127(GPIO04)* 143((CAN_RX)_RSVD)* 145((CAN_TX)_RSVD)* 178(MOD_SLEEP*)* 189(I2C1_SCL)* 191(I2C1_SDA)* 193(I2S0_DOUT)* 195(I2S0_DIN)* 197(I2S0_FS)* 199(I2S0_SCLK)* 203(UART1_TXD)* 205(UART1_RXD)* 207(UART1_RTS*)* 209(UART1_CTS*)* 211(GPIO09)* 219(SDMMC_DAT0)* 223(SDMMC_DAT2)* 225(SDMMC_DAT3)* 227(SDMMC_CMD)* 229(SDMMC_CLK)* 232(I2C2_SCL)* 234(I2C2_SDA)* 240(SLEEP/WAKE*)*

### Layout directives
differential pair: ENET_TRD0_N, ENET_TRD0_P, ENET_TRD1_N, ENET_TRD1_P, ENET_TRD2_N, ENET_TRD2_P, ENET_TRD3_N, ENET_TRD3_P, OTG_USB_D_N, OTG_USB_D_P, PCIE0_CLK_N, PCIE0_CLK_P, PCIE0_RX0_N, PCIE0_RX0_P, PCIE0_RX1_N, PCIE0_RX1_P, PCIE0_RX2_N, PCIE0_RX2_P, PCIE0_RX3_N, PCIE0_RX3_P, PCIE0_TX0_N, PCIE0_TX0_P, PCIE0_TX1_N, PCIE0_TX1_P, PCIE0_TX2_N, PCIE0_TX2_P, PCIE0_TX3_N, PCIE0_TX3_P, PCIE_CLK_N, PCIE_CLK_P, PCIE_RX0_N, PCIE_RX0_P, PCIE_TX0_N, PCIE_TX0_P, USB1_D_N, USB1_D_P, USB2_AP_N, USB2_AP_P, USBSS_RX6_N, USBSS_RX6_P, USBSS_TX6_N, USBSS_TX6_P
net class Z_90: OTG_USB_D_N, OTG_USB_D_P, USB1_D_N, USB1_D_P, USB2_AP_N, USB2_AP_P, USBSS_RX6_N, USBSS_RX6_P, USBSS_TX6_N, USBSS_TX6_P
net class Z_100: ENET_TRD0_N, ENET_TRD0_P, ENET_TRD1_N, ENET_TRD1_P, ENET_TRD2_N, ENET_TRD2_P, ENET_TRD3_N, ENET_TRD3_P
net class Z_85: PCIE0_CLK_N, PCIE0_CLK_P, PCIE0_RX0_N, PCIE0_RX0_P, PCIE0_RX1_N, PCIE0_RX1_P, PCIE0_RX2_N, PCIE0_RX2_P, PCIE0_RX3_N, PCIE0_RX3_P, PCIE0_TX0_N, PCIE0_TX0_P, PCIE0_TX1_N, PCIE0_TX1_P, PCIE0_TX2_N, PCIE0_TX2_P, PCIE0_TX3_N, PCIE0_TX3_P, PCIE_CLK_N, PCIE_CLK_P, PCIE_RX0_N, PCIE_RX0_P, PCIE_TX0_N, PCIE_TX0_P

### Notes on the sheet
- (near J12) SoM interfaces
- Bypass Capacitors
- System Buttons
- Module power
- System Status
- Mounting studs
- Mechanical model
- Title
- Size:
- Date:
- A3
- Number:
- Time:
- Revision:
- Sheet
- of
- Go360.io
- (in symbol jetson-nano-new-release, part A) Please check with Nvidia before using functions that end with a '*'

### Library data of the parts
BAT1 = battery: Rechargeable Battery, Coin Cell, Single Cell, 3 V, Lithium Manganese Dioxide, 5.5 mAh, Button Cell; Manufacturer: SEIKO INSTRUMENTS; PartNumber: MS621FE-FL11E; Value: MS621FE-FL11E; PartSymbol: MS621FE-FL11E; Class: Battery
BOOT PWR = LED: LED Green 0603 case; PartNumber: LED_G; Manufacturer: ROHM Semicon; Value: SML-310MTT86; PartSymbol: SML-310MTT86
C73 C74 = C_100u_1206: MLCC SMT Capacitor 100uF 1206; Manufacturer: Taiyo Yuden; PartSymbol: JMK316BJ107ML-T; PartNumber: C_100u_1206; Value: 100u
F1 = Fuse: PTC RESET 6V LO RHO 1206 4.50A; PartNumber: LITTELFUSE_1206L450SLWR; Manufacturer: LITTELFUSE; Value: 1206L450SLWR
M1 = jetson-nano-new-release: PartNumber: 2309413-1; PartSymbol: 2309413-1; Value: 2309413-1
R71 R72 = R_470R_0402: RES, 470R, 0402; Manufacturer: VISHAY; PartSymbol: CRCW0402470RFKED.; PartNumber: R_470R_0402; Value: 470R
REC1 RST1 = TL3340AF160QG: E-SWITCH  TL3340AF160QG  SWITCH, TACTILE SPST 50mA, SMD GULL WING; Value: TL3340AF160QG; PartNumber: TL3340AF160QG; PartSymbol: TL3340AF160QG
SP2-SP7 = SPACER: M2.5-6mm; PartNumber: M2.5x6; Manufacturer: WURTH ELEKTRONIK; Value: 9774060151; PartSymbol: 9774060151
T2 T3 = NMOS: MOSFET, N CH, 60V, 0.2A; Manufacturer: NXP; Value: BSS138PW; PartNumber: BSS138PW; PartSymbol: BSS138PW

## Sheet WIFI_BT.SchDoc
size A3
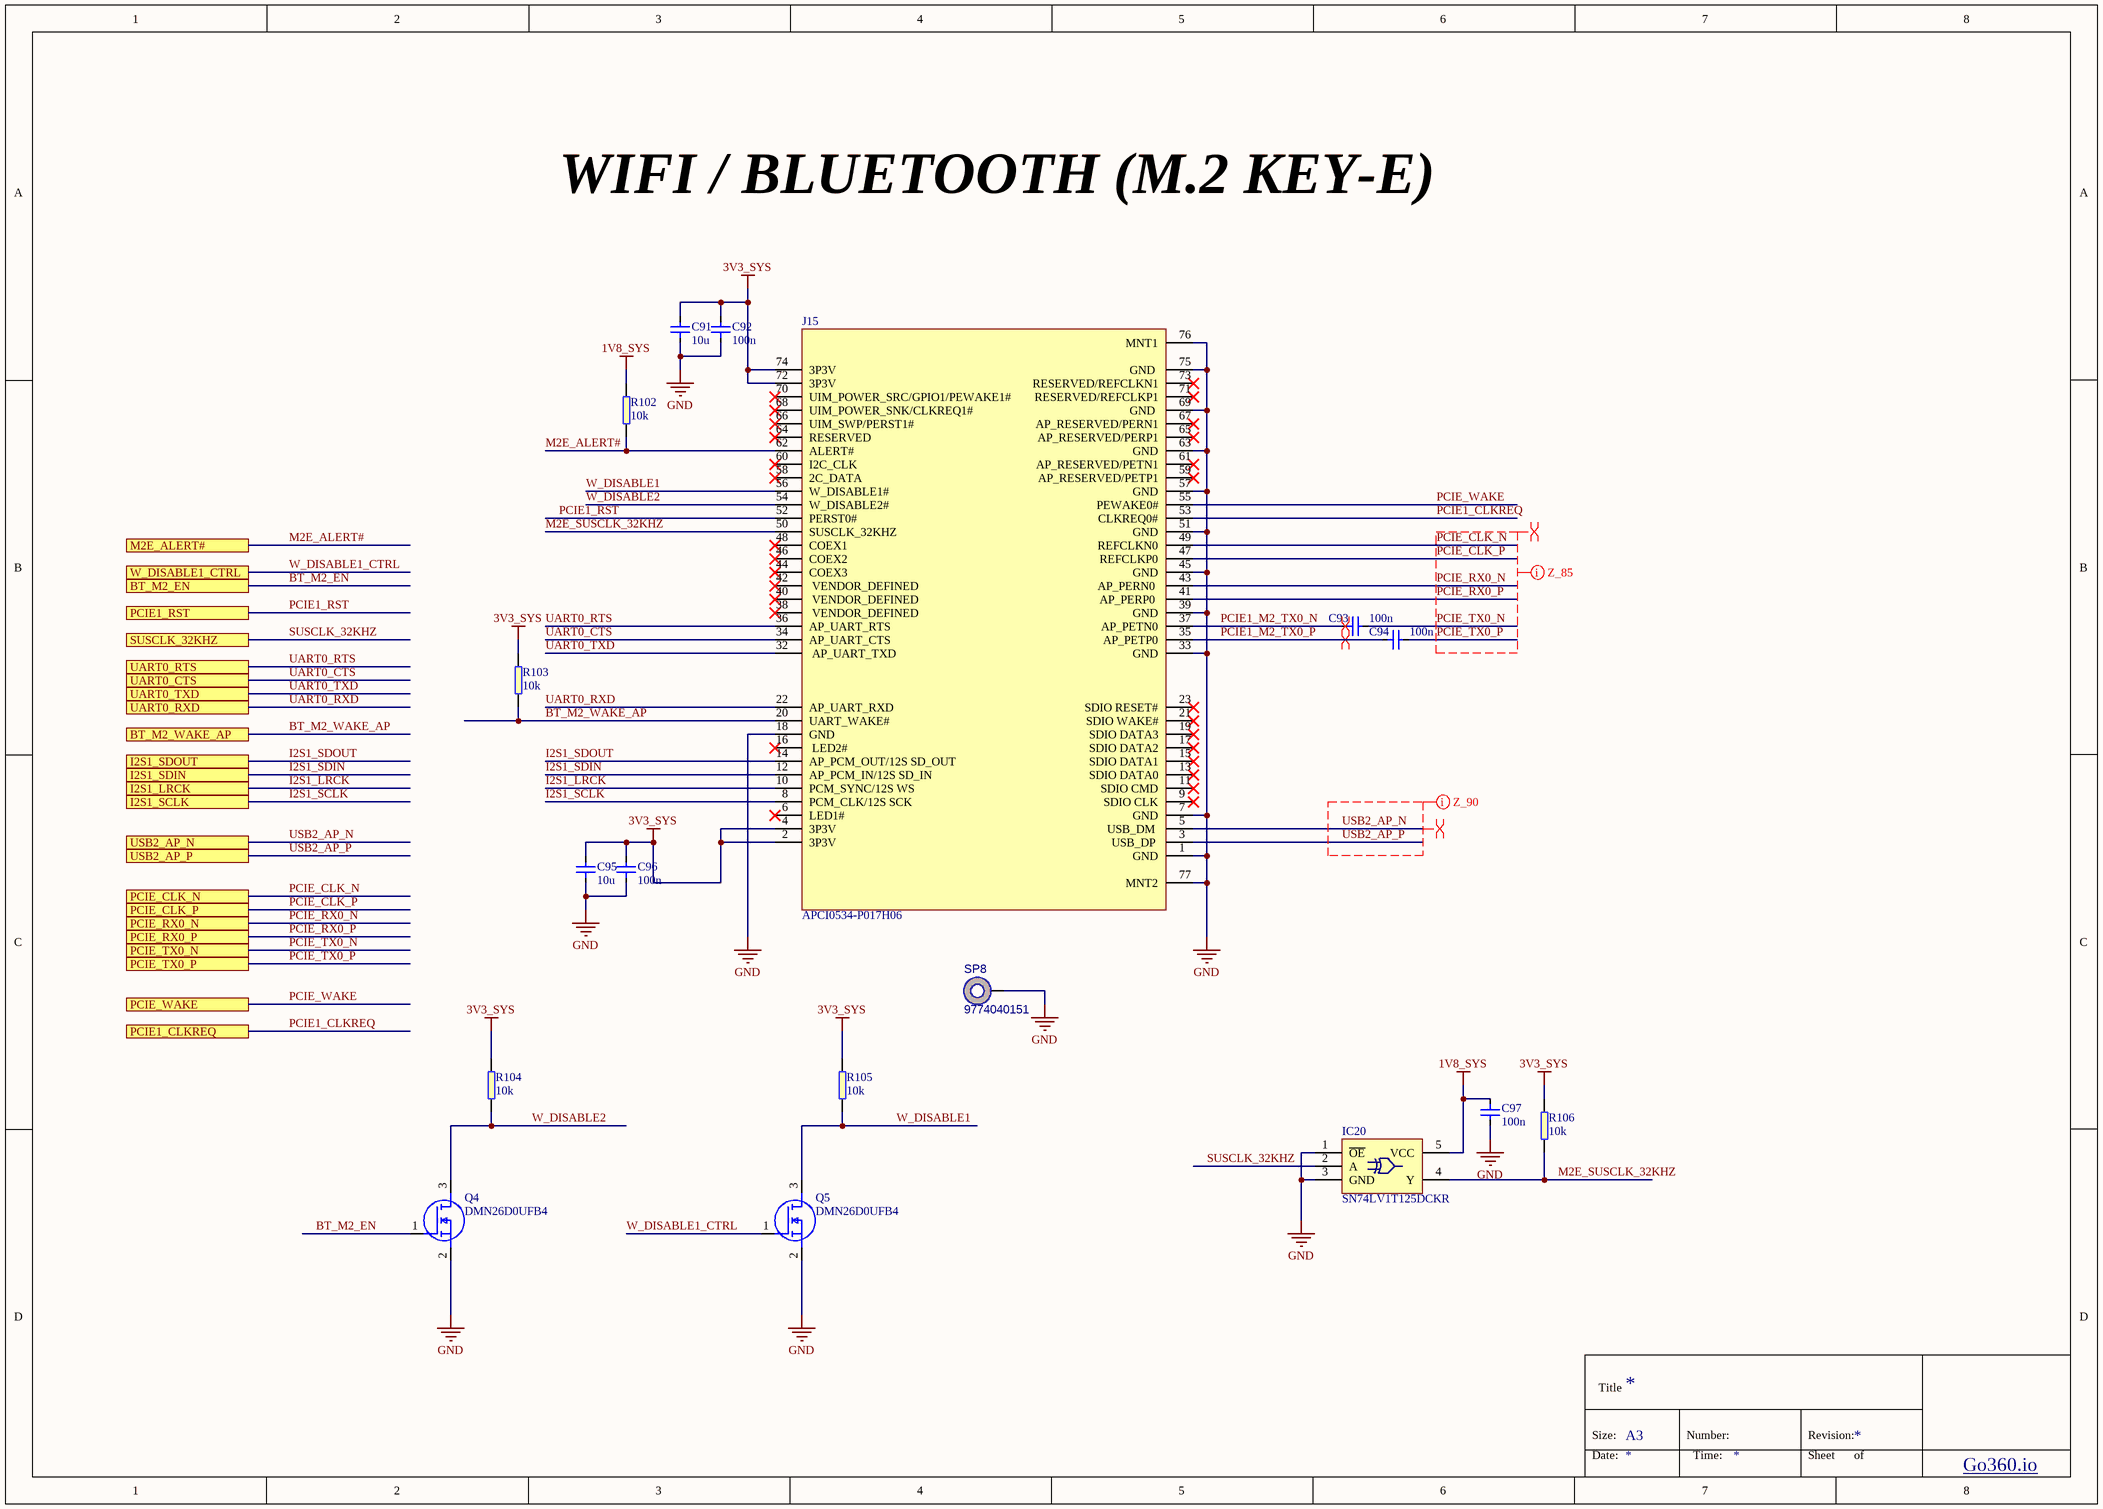
[diagram p3: WIFI_BT.SchDoc]

### Parts
C91  10u  [C0603]
C92  100n  [C0402]
C93  100n  [C0402]
C94  100n  [C0402]
C95  10u  [C0603]
C96  100n  [C0402]
C97  100n  [C0402]
IC20  SN74LV1T125DCKR  [SC70-5]
J15  APCI0534-P017H06  [CON_MINIPEX_067_SMT_RA_M2_KEYE_C]
Q4  DMN26D0UFB4  [DMN26D0UFB47]
Q5  DMN26D0UFB4  [DMN26D0UFB47]
R102  10k  [R0402]
R103  10k  [R0402]
R104  10k  [R0402]
R105  10k  [R0402]
R106  10k  [R0402]
SP8  9774040151  [MEC_STANDOFF_PTH_620C380P]

### Ports
BT_M2_EN, BT_M2_WAKE_AP, I2S1_LRCK, I2S1_SCLK, I2S1_SDIN, I2S1_SDOUT, M2E_ALERT#, PCIE1_CLKREQ, PCIE1_RST, PCIE_CLK_N, PCIE_CLK_P, PCIE_RX0_N, PCIE_RX0_P, PCIE_TX0_N, PCIE_TX0_P, PCIE_WAKE, SUSCLK_32KHZ, UART0_CTS, UART0_RTS, UART0_RXD, UART0_TXD, USB2_AP_N, USB2_AP_P, W_DISABLE1_CTRL

### Nets
1V8_SYS: C97.1 IC20.5(VCC) R102.2
3V3_SYS: C91.2 C92.2 C95.2 C96.2 J15.2(3P3V) J15.4(3P3V) J15.72(3P3V) J15.74(3P3V) R103.2 R104.2 R105.2 R106.2
GND: C91.1 C92.1 C95.1 C96.1 C97.2 IC20.1(~{OE}) IC20.3(GND) J15.1(GND) J15.7(GND) J15.18(GND) J15.33(GND) J15.39(GND) J15.45(GND) J15.51(GND) J15.57(GND) J15.63(GND) J15.69(GND) J15.75(GND) J15.76(MNT1) J15.77(MNT2) Q4.2(S) Q5.2(S) SP8.1
BT_M2_EN: Q4.1(G) ; port BT_M2_EN
BT_M2_WAKE_AP: J15.20(UART_WAKE#) R103.1 ; port BT_M2_WAKE_AP
I2S1_LRCK: J15.10(PCM_SYNC/12S_WS) ; port I2S1_LRCK
I2S1_SCLK: J15.8(PCM_CLK/12S_SCK) ; port I2S1_SCLK
I2S1_SDIN: J15.12(AP_PCM_IN/12S_SD_IN) ; port I2S1_SDIN
I2S1_SDOUT: J15.14(AP_PCM_OUT/12S_SD_OUT) ; port I2S1_SDOUT
M2E_ALERT#: J15.62(ALERT#) R102.1 ; port M2E_ALERT#
M2E_SUSCLK_32KHZ: IC20.4(Y) J15.50(SUSCLK_32KHZ) R106.1
PCIE1_CLKREQ: J15.53(CLKREQ0#) ; port PCIE1_CLKREQ
PCIE1_M2_TX0_N: C93.1 J15.37(AP_PETN0)
PCIE1_M2_TX0_P: C94.1 J15.35(AP_PETP0)
PCIE1_RST: J15.52(PERST0#) ; port PCIE1_RST
PCIE_CLK_N: J15.49(REFCLKN0) ; port PCIE_CLK_N
PCIE_CLK_P: J15.47(REFCLKP0) ; port PCIE_CLK_P
PCIE_RX0_N: J15.43(AP_PERN0) ; port PCIE_RX0_N
PCIE_RX0_P: J15.41(AP_PERP0) ; port PCIE_RX0_P
PCIE_TX0_N: C93.2 ; port PCIE_TX0_N
PCIE_TX0_P: C94.2 ; port PCIE_TX0_P
PCIE_WAKE: J15.55(PEWAKE0#) ; port PCIE_WAKE
SUSCLK_32KHZ: IC20.2(A) ; port SUSCLK_32KHZ
UART0_CTS: J15.34(AP_UART_CTS) ; port UART0_CTS
UART0_RTS: J15.36(AP_UART_RTS) ; port UART0_RTS
UART0_RXD: J15.22(AP_UART_RXD) ; port UART0_RXD
UART0_TXD: J15.32(AP_UART_TXD) ; port UART0_TXD
USB2_AP_N: J15.5(USB_DM) ; port USB2_AP_N
USB2_AP_P: J15.3(USB_DP) ; port USB2_AP_P
W_DISABLE1: J15.56(W_DISABLE1#) Q5.3(D) R105.1
W_DISABLE1_CTRL: Q5.1(G) ; port W_DISABLE1_CTRL
W_DISABLE2: J15.54(W_DISABLE2#) Q4.3(D) R104.1

Not connected (* = marked no-connect by the designer): J15 6(LED1#)* 9(_SDIO_CLK)* 11(SDIO_CMD)* 13(SDIO_DATA0)* 15(SDIO_DATA1)* 16(_LED2#)* 17(SDIO_DATA2)* 19(SDIO_DATA3)* 21(SDIO_WAKE#)* 23(SDIO_RESET#)* 38(_VENDOR_DEFINED)* 40(_VENDOR_DEFINED)* 42(_VENDOR_DEFINED)* 44(COEX3)* 46(COEX2)* 48(COEX1)* 58(2C_DATA)* 59(AP_RESERVED/PETP1)* 60(I2C_CLK)* 61(AP_RESERVED/PETN1)* 64(RESERVED)* 65(AP_RESERVED/PERP1)* 66(UIM_SWP/PERST1#)* 67(AP_RESERVED/PERN1)* 68(UIM_POWER_SNK/CLKREQ1#)* 70(UIM_POWER_SRC/GPIO1/PEWAKE1#)* 71(RESERVED/REFCLKP1)* 73(RESERVED/REFCLKN1)*

### Layout directives
mark named Z_85: PCIE_CLK_N, PCIE_CLK_P, PCIE_RX0_N, PCIE_RX0_P, PCIE_TX0_N, PCIE_TX0_P
differential pair: PCIE1_M2_TX0_N, PCIE1_M2_TX0_P, PCIE_CLK_N, PCIE_CLK_P, PCIE_RX0_N, PCIE_RX0_P, PCIE_TX0_N, PCIE_TX0_P, USB2_AP_N
net class Z_90: USB2_AP_N, USB2_AP_P

### Notes on the sheet
- WIFI / BLUETOOTH (M.2 KEY-E)
- Title
- Size:
- Date:
- A3
- Number:
- Time:
- Revision:
- Sheet
- of
- Go360.io

### Library data of the parts
C91 C95 = C_10u_0603: as C52 on sheet POWER; PartNumber: C_10u_0603; Value: 10u
C92-C94 C96 C97 = C_100n_0402: as C48 on sheet POWER; PartNumber: C_100n_0402; Value: 100n
IC20 = SN74LV1T125: Buffer, 74LV1T125, 1.6 V to 5.5 V, SOT-23-5; Manufacturer: Texas Instruments; PartNumber: SN74LV1T125DCKR; Value: SN74LV1T125DCKR; PartSymbol: SN74LV1T125DCKR
Q4 Q5 = DMN26D0UFB4: as Q1 on sheet POWER; Datasheet Link: https://componentsearchengine.com/Datasheets/1/DMN26D0UFB4-7.pdf; Height: 0.4mm; Arrow Part Number: DMN26D0UFB4-7; Arrow Price/Stock: https://www.arrow.com/en/products/dmn26d0ufb4-7/diodes-incorporated; Mouser Part Number: 621-DMN26D0UFB4-7; Mouser Price/Stock: https://www.mouser.co.uk/ProductDetail/Diodes-Incorporated/DMN26D0UFB4-7?qs=GWgl%252BsiMZr%252B4pznsTuF3iQ%3D%3D
R102-R106 = R_10k_0402: as R44 on sheet POWER; PartNumber: R_10k_0402; Value: 10k
SP8 = 9774040151: RND STANDOFF M2.5X0.45 STEEL 4MM; Manufacturer: WURTH ELEKTRONIK; PartNumber: 9774040151; Value: 9774040151; PartSymbol: 9774040151
J15 = APCI0534-P017H06: part number: APCI0534-P017H06

## Sheet NVME.SchDoc
size A3
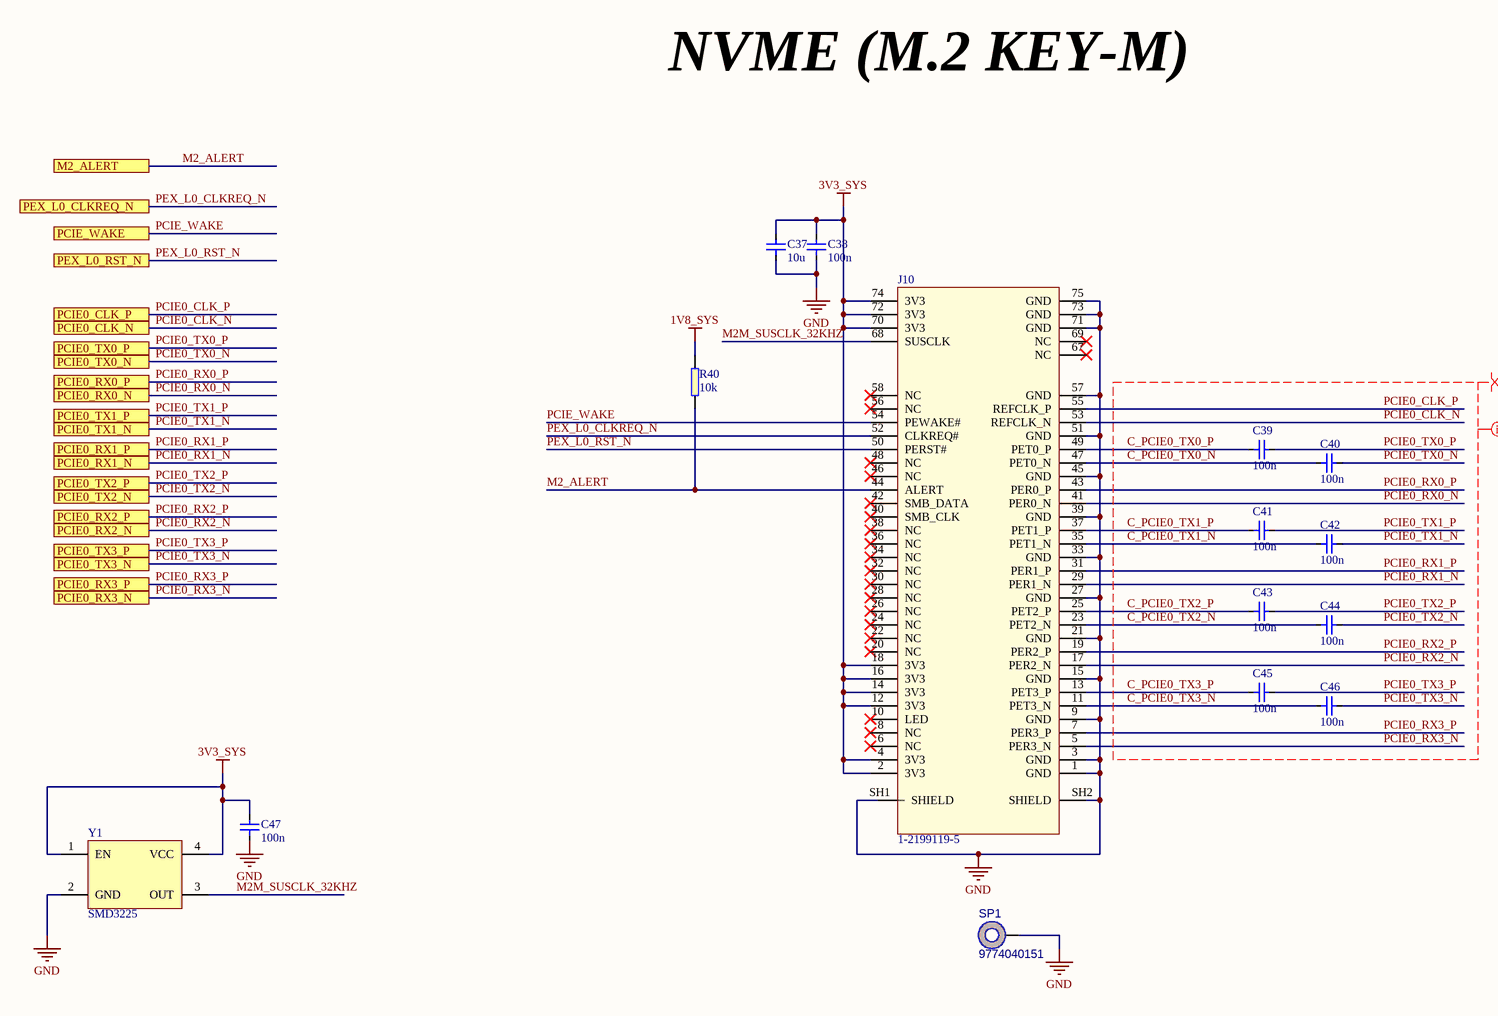
[diagram p4: NVME.SchDoc]

### Parts
C37  10u  [C0603]
C38  100n  [C0402]
C39  100n  [C0402]
C40  100n  [C0402]
C41  100n  [C0402]
C42  100n  [C0402]
C43  100n  [C0402]
C44  100n  [C0402]
C45  100n  [C0402]
C46  100n  [C0402]
C47  100n  [C0402]
J10  1-2199119-5  [1-2199119-5]
R40  10k  [R0402]
SP1  9774040151  [MEC_STANDOFF_PTH_620C380P]
Y1  SMD3225  [XTAL_SMD_4_032X025_D]

### Ports
M2_ALERT, PCIE0_CLK_N, PCIE0_CLK_P, PCIE0_RX0_N, PCIE0_RX0_P, PCIE0_RX1_N, PCIE0_RX1_P, PCIE0_RX2_N, PCIE0_RX2_P, PCIE0_RX3_N, PCIE0_RX3_P, PCIE0_TX0_N, PCIE0_TX0_P, PCIE0_TX1_N, PCIE0_TX1_P, PCIE0_TX2_N, PCIE0_TX2_P, PCIE0_TX3_N, PCIE0_TX3_P, PCIE_WAKE, PEX_L0_CLKREQ_N, PEX_L0_RST_N

### Nets
1V8_SYS: R40.2
3V3_SYS: C37.2 C38.2 C47.2 J10.2(3V3) J10.4(3V3) J10.12(3V3) J10.14(3V3) J10.16(3V3) J10.18(3V3) J10.70(3V3) J10.72(3V3) J10.74(3V3) Y1.1(EN) Y1.4(VCC)
GND: C37.1 C38.1 C47.1 J10.1(GND) J10.3(GND) J10.9(GND) J10.15(GND) J10.21(GND) J10.27(GND) J10.33(GND) J10.39(GND) J10.45(GND) J10.51(GND) J10.57(GND) J10.71(GND) J10.73(GND) J10.75(GND) J10.SH1(SHIELD) J10.SH2(SHIELD) SP1.1 Y1.2(GND)
C_PCIE0_TX0_N: C40.1 J10.47(PET0_N)
C_PCIE0_TX0_P: C39.1 J10.49(PET0_P)
C_PCIE0_TX1_N: C42.1 J10.35(PET1_N)
C_PCIE0_TX1_P: C41.1 J10.37(PET1_P)
C_PCIE0_TX2_N: C44.1 J10.23(PET2_N)
C_PCIE0_TX2_P: C43.1 J10.25(PET2_P)
C_PCIE0_TX3_N: C46.1 J10.11(PET3_N)
C_PCIE0_TX3_P: C45.1 J10.13(PET3_P)
M2_ALERT: J10.44(ALERT) R40.1 ; port M2_ALERT
M2M_SUSCLK_32KHZ: J10.68(SUSCLK) Y1.3(OUT)
PCIE0_CLK_N: J10.53(REFCLK_N) ; port PCIE0_CLK_N
PCIE0_CLK_P: J10.55(REFCLK_P) ; port PCIE0_CLK_P
PCIE0_RX0_N: J10.41(PER0_N) ; port PCIE0_RX0_N
PCIE0_RX0_P: J10.43(PER0_P) ; port PCIE0_RX0_P
PCIE0_RX1_N: J10.29(PER1_N) ; port PCIE0_RX1_N
PCIE0_RX1_P: J10.31(PER1_P) ; port PCIE0_RX1_P
PCIE0_RX2_N: J10.17(PER2_N) ; port PCIE0_RX2_N
PCIE0_RX2_P: J10.19(PER2_P) ; port PCIE0_RX2_P
PCIE0_RX3_N: J10.5(PER3_N) ; port PCIE0_RX3_N
PCIE0_RX3_P: J10.7(PER3_P) ; port PCIE0_RX3_P
PCIE0_TX0_N: C40.2 ; port PCIE0_TX0_N
PCIE0_TX0_P: C39.2 ; port PCIE0_TX0_P
PCIE0_TX1_N: C42.2 ; port PCIE0_TX1_N
PCIE0_TX1_P: C41.2 ; port PCIE0_TX1_P
PCIE0_TX2_N: C44.2 ; port PCIE0_TX2_N
PCIE0_TX2_P: C43.2 ; port PCIE0_TX2_P
PCIE0_TX3_N: C46.2 ; port PCIE0_TX3_N
PCIE0_TX3_P: C45.2 ; port PCIE0_TX3_P
PCIE_WAKE: J10.54(PEWAKE#) ; port PCIE_WAKE
PEX_L0_CLKREQ_N: J10.52(CLKREQ#) ; port PEX_L0_CLKREQ_N
PEX_L0_RST_N: J10.50(PERST#) ; port PEX_L0_RST_N

Not connected (* = marked no-connect by the designer): J10 6(NC)* 8(NC)* 10(LED)* 20(NC)* 22(NC)* 24(NC)* 26(NC)* 28(NC)* 30(NC)* 32(NC)* 34(NC)* 36(NC)* 38(NC)* 40(SMB_CLK)* 42(SMB_DATA)* 46(NC)* 48(NC)* 56(NC)* 58(NC)* 67(NC)* 69(NC)*

### Layout directives
differential pair: C_PCIE0_TX0_N, C_PCIE0_TX0_P, C_PCIE0_TX1_N, C_PCIE0_TX1_P, C_PCIE0_TX2_N, C_PCIE0_TX2_P, C_PCIE0_TX3_N, C_PCIE0_TX3_P, PCIE0_CLK_N, PCIE0_CLK_P, PCIE0_RX0_N, PCIE0_RX0_P, PCIE0_RX1_N, PCIE0_RX1_P, PCIE0_RX2_N, PCIE0_RX2_P, PCIE0_RX3_N, PCIE0_RX3_P, PCIE0_TX0_N, PCIE0_TX0_P, PCIE0_TX1_N, PCIE0_TX1_P, PCIE0_TX2_N, PCIE0_TX2_P, PCIE0_TX3_N, PCIE0_TX3_P
net class Z_85: C_PCIE0_TX0_N, C_PCIE0_TX0_P, C_PCIE0_TX1_N, C_PCIE0_TX1_P, C_PCIE0_TX2_N, C_PCIE0_TX2_P, C_PCIE0_TX3_N, C_PCIE0_TX3_P, PCIE0_CLK_N, PCIE0_CLK_P, PCIE0_RX0_N, PCIE0_RX0_P, PCIE0_RX1_N, PCIE0_RX1_P, PCIE0_RX2_N, PCIE0_RX2_P, PCIE0_RX3_N, PCIE0_RX3_P, PCIE0_TX0_N, PCIE0_TX0_P, PCIE0_TX1_N, PCIE0_TX1_P, PCIE0_TX2_N, PCIE0_TX2_P, PCIE0_TX3_N, PCIE0_TX3_P

### Notes on the sheet
- NVME (M.2 KEY-M)
- Title
- Size:
- Date:
- A3
- Number:
- Time:
- Revision:
- Sheet
- of
- Go360.io

### Library data of the parts
C37 = C_10u_0603: as C52 on sheet POWER; PartNumber: C_10u_0603; Value: 10u
C38-C47 = C_100n_0402: as C48 on sheet POWER; PartNumber: C_100n_0402; Value: 100n
J10 = 1-2199119-5: CONN FEMALE 67POS 0.020 GOLD; Manufacturer: TE; PartNumber: 1-2199119-5; Value: 1-2199119-5
R40 = R_10k_0402: as R44 on sheet POWER; PartNumber: R_10k_0402; Value: 10k
SP1 = 9774040151: as SP8 on sheet WIFI_BT; PartNumber: 9774040151; Value: 9774040151; PartSymbol: 9774040151

## Sheet CSI.SchDoc
size A3
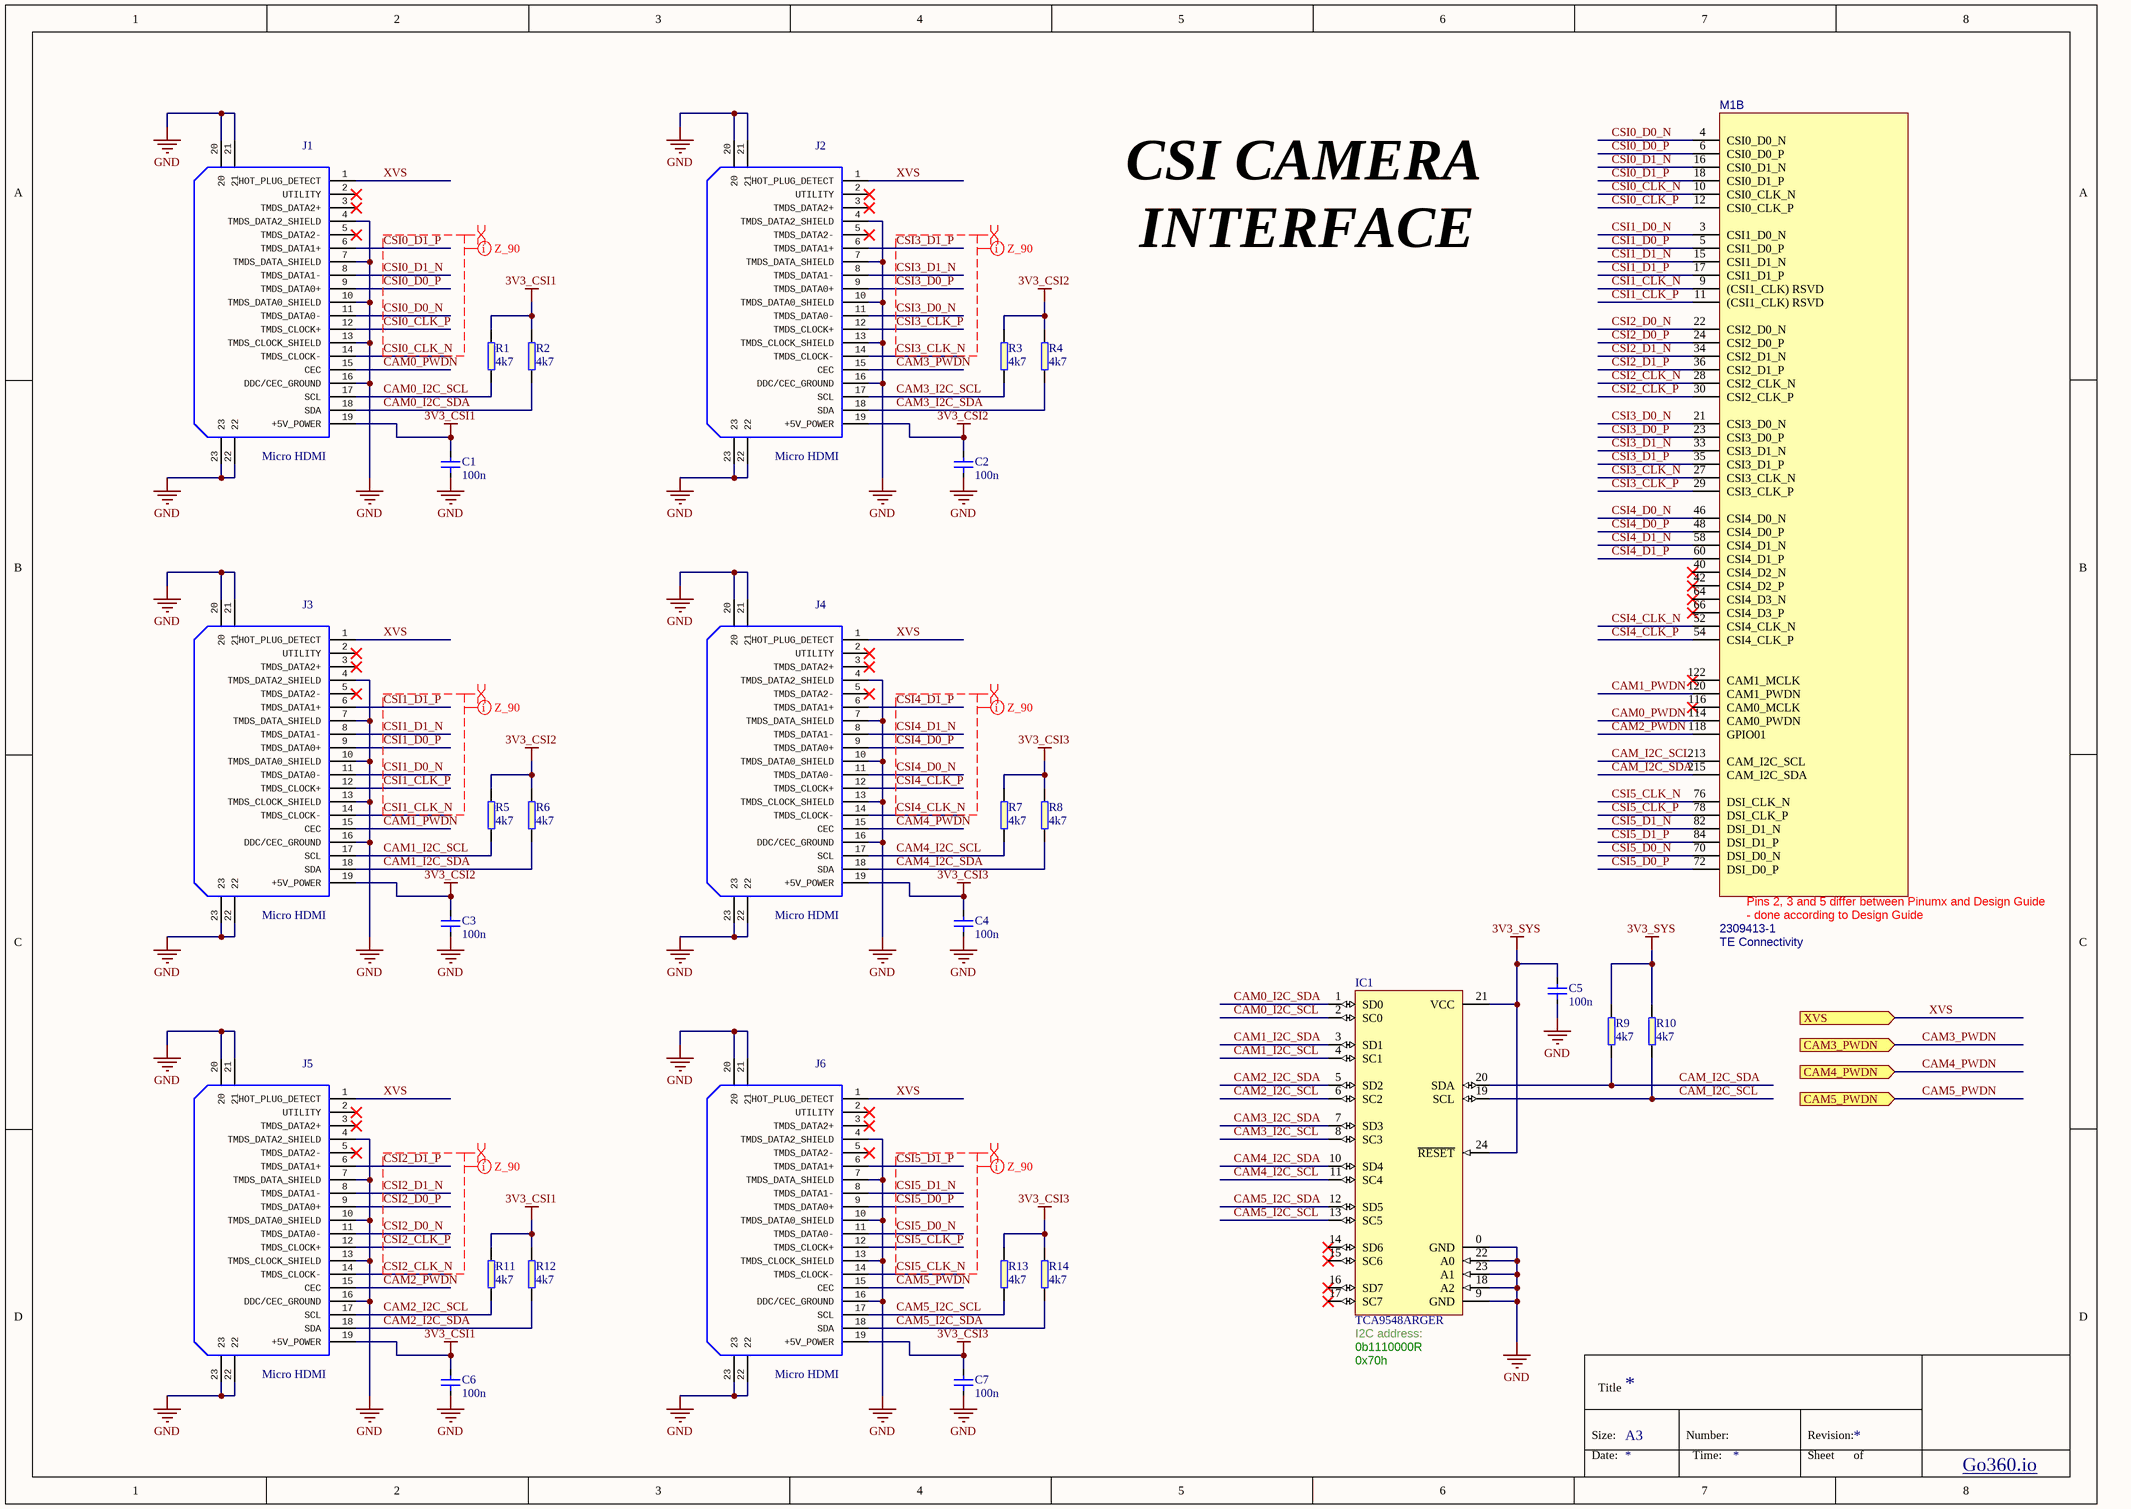
[diagram p5: CSI.SchDoc]

### Parts
C1  100n  [C0402]
C2  100n  [C0402]
C3  100n  [C0402]
C4  100n  [C0402]
C5  100n  [C0402]
C6  100n  [C0402]
C7  100n  [C0402]
IC1  TCA9548ARGER  [VQFN-24]
J1  Micro HDMI  [HDMI-0467650301]
J2  Micro HDMI  [HDMI-0467650301]
J3  Micro HDMI  [HDMI-0467650301]
J4  Micro HDMI  [HDMI-0467650301]
J5  Micro HDMI  [HDMI-0467650301]
J6  Micro HDMI  [HDMI-0467650301]
M1  Manufacturer: TE Connectivity  [jetson-nano-connector]  (hidden comment: 2309413-1)  (part B of 7)
R1  4k7  [R0402]
R2  4k7  [R0402]
R3  4k7  [R0402]
R4  4k7  [R0402]
R5  4k7  [R0402]
R6  4k7  [R0402]
R7  4k7  [R0402]
R8  4k7  [R0402]
R9  4k7  [R0402]
R10  4k7  [R0402]
R11  4k7  [R0402]
R12  4k7  [R0402]
R13  4k7  [R0402]
R14  4k7  [R0402]

### Ports
CAM3_PWDN (in), CAM4_PWDN (in), CAM5_PWDN (in), XVS (in)

### Nets
3V3_CSI1: C1.2 C6.2 J1.19(+5V_POWER) J5.19(+5V_POWER) R1.2 R2.2 R11.2 R12.2
3V3_CSI2: C2.2 C3.2 J2.19(+5V_POWER) J3.19(+5V_POWER) R3.2 R4.2 R5.2 R6.2
3V3_CSI3: C4.2 C7.2 J4.19(+5V_POWER) J6.19(+5V_POWER) R7.2 R8.2 R13.2 R14.2
3V3_SYS: C5.2 IC1.21(VCC) IC1.24(~{RESET}) R9.2 R10.2
GND: C1.1 C2.1 C3.1 C4.1 C5.1 C6.1 C7.1 IC1.0(GND) IC1.9(GND) IC1.18(A2) IC1.22(A0) IC1.23(A1) J1.4(TMDS_DATA2_SHIELD) J1.7(TMDS_DATA_SHIELD) J1.10(TMDS_DATA0_SHIELD) J1.13(TMDS_CLOCK_SHIELD) J1.16(DDC/CEC_GROUND) J1.20 J1.21 J1.22 J1.23 J2.4(TMDS_DATA2_SHIELD) J2.7(TMDS_DATA_SHIELD) J2.10(TMDS_DATA0_SHIELD) J2.13(TMDS_CLOCK_SHIELD) J2.16(DDC/CEC_GROUND) J2.20 J2.21 J2.22 J2.23 J3.4(TMDS_DATA2_SHIELD) J3.7(TMDS_DATA_SHIELD) J3.10(TMDS_DATA0_SHIELD) J3.13(TMDS_CLOCK_SHIELD) J3.16(DDC/CEC_GROUND) J3.20 J3.21 J3.22 J3.23 J4.4(TMDS_DATA2_SHIELD) J4.7(TMDS_DATA_SHIELD) J4.10(TMDS_DATA0_SHIELD) J4.13(TMDS_CLOCK_SHIELD) J4.16(DDC/CEC_GROUND) J4.20 J4.21 J4.22 J4.23 J5.4(TMDS_DATA2_SHIELD) J5.7(TMDS_DATA_SHIELD) J5.10(TMDS_DATA0_SHIELD) J5.13(TMDS_CLOCK_SHIELD) J5.16(DDC/CEC_GROUND) J5.20 J5.21 J5.22 J5.23 J6.4(TMDS_DATA2_SHIELD) J6.7(TMDS_DATA_SHIELD) J6.10(TMDS_DATA0_SHIELD) J6.13(TMDS_CLOCK_SHIELD) J6.16(DDC/CEC_GROUND) J6.20 J6.21 J6.22 J6.23
CAM0_I2C_SCL: IC1.2(SC0) J1.17(SCL) R1.1
CAM0_I2C_SDA: IC1.1(SD0) J1.18(SDA) R2.1
CAM0_PWDN: J1.15(CEC) M1.114(CAM0_PWDN)
CAM1_I2C_SCL: IC1.4(SC1) J3.17(SCL) R5.1
CAM1_I2C_SDA: IC1.3(SD1) J3.18(SDA) R6.1
CAM1_PWDN: J3.15(CEC) M1.120(CAM1_PWDN)
CAM2_I2C_SCL: IC1.6(SC2) J5.17(SCL) R11.1
CAM2_I2C_SDA: IC1.5(SD2) J5.18(SDA) R12.1
CAM2_PWDN: J5.15(CEC) M1.118(GPIO01)
CAM3_I2C_SCL: IC1.8(SC3) J2.17(SCL) R3.1
CAM3_I2C_SDA: IC1.7(SD3) J2.18(SDA) R4.1
CAM3_PWDN: J2.15(CEC) ; port CAM3_PWDN
CAM4_I2C_SCL: IC1.11(SC4) J4.17(SCL) R7.1
CAM4_I2C_SDA: IC1.10(SD4) J4.18(SDA) R8.1
CAM4_PWDN: J4.15(CEC) ; port CAM4_PWDN
CAM5_I2C_SCL: IC1.13(SC5) J6.17(SCL) R13.1
CAM5_I2C_SDA: IC1.12(SD5) J6.18(SDA) R14.1
CAM5_PWDN: J6.15(CEC) ; port CAM5_PWDN
CAM_I2C_SCL: IC1.19(SCL) M1.213(CAM_I2C_SCL) R10.1
CAM_I2C_SDA: IC1.20(SDA) M1.215(CAM_I2C_SDA) R9.1
CSI0_CLK_N: J1.14(TMDS_CLOCK-) M1.10(CSI0_CLK_N)
CSI0_CLK_P: J1.12(TMDS_CLOCK+) M1.12(CSI0_CLK_P)
CSI0_D0_N: J1.11(TMDS_DATA0-) M1.4(CSI0_D0_N)
CSI0_D0_P: J1.9(TMDS_DATA0+) M1.6(CSI0_D0_P)
CSI0_D1_N: J1.8(TMDS_DATA1-) M1.16(CSI0_D1_N)
CSI0_D1_P: J1.6(TMDS_DATA1+) M1.18(CSI0_D1_P)
CSI1_CLK_N: J3.14(TMDS_CLOCK-) M1.9((CSI1_CLK)_RSVD)
CSI1_CLK_P: J3.12(TMDS_CLOCK+) M1.11((CSI1_CLK)_RSVD)
CSI1_D0_N: J3.11(TMDS_DATA0-) M1.3(CSI1_D0_N)
CSI1_D0_P: J3.9(TMDS_DATA0+) M1.5(CSI1_D0_P)
CSI1_D1_N: J3.8(TMDS_DATA1-) M1.15(CSI1_D1_N)
CSI1_D1_P: J3.6(TMDS_DATA1+) M1.17(CSI1_D1_P)
CSI2_CLK_N: J5.14(TMDS_CLOCK-) M1.28(CSI2_CLK_N)
CSI2_CLK_P: J5.12(TMDS_CLOCK+) M1.30(CSI2_CLK_P)
CSI2_D0_N: J5.11(TMDS_DATA0-) M1.22(CSI2_D0_N)
CSI2_D0_P: J5.9(TMDS_DATA0+) M1.24(CSI2_D0_P)
CSI2_D1_N: J5.8(TMDS_DATA1-) M1.34(CSI2_D1_N)
CSI2_D1_P: J5.6(TMDS_DATA1+) M1.36(CSI2_D1_P)
CSI3_CLK_N: J2.14(TMDS_CLOCK-) M1.27(CSI3_CLK_N)
CSI3_CLK_P: J2.12(TMDS_CLOCK+) M1.29(CSI3_CLK_P)
CSI3_D0_N: J2.11(TMDS_DATA0-) M1.21(CSI3_D0_N)
CSI3_D0_P: J2.9(TMDS_DATA0+) M1.23(CSI3_D0_P)
CSI3_D1_N: J2.8(TMDS_DATA1-) M1.33(CSI3_D1_N)
CSI3_D1_P: J2.6(TMDS_DATA1+) M1.35(CSI3_D1_P)
CSI4_CLK_N: J4.14(TMDS_CLOCK-) M1.52(CSI4_CLK_N)
CSI4_CLK_P: J4.12(TMDS_CLOCK+) M1.54(CSI4_CLK_P)
CSI4_D0_N: J4.11(TMDS_DATA0-) M1.46(CSI4_D0_N)
CSI4_D0_P: J4.9(TMDS_DATA0+) M1.48(CSI4_D0_P)
CSI4_D1_N: J4.8(TMDS_DATA1-) M1.58(CSI4_D1_N)
CSI4_D1_P: J4.6(TMDS_DATA1+) M1.60(CSI4_D1_P)
CSI5_CLK_N: J6.14(TMDS_CLOCK-) M1.76(DSI_CLK_N)
CSI5_CLK_P: J6.12(TMDS_CLOCK+) M1.78(DSI_CLK_P)
CSI5_D0_N: J6.11(TMDS_DATA0-) M1.70(DSI_D0_N)
CSI5_D0_P: J6.9(TMDS_DATA0+) M1.72(DSI_D0_P)
CSI5_D1_N: J6.8(TMDS_DATA1-) M1.82(DSI_D1_N)
CSI5_D1_P: J6.6(TMDS_DATA1+) M1.84(DSI_D1_P)
XVS: J1.1(HOT_PLUG_DETECT) J2.1(HOT_PLUG_DETECT) J3.1(HOT_PLUG_DETECT) J4.1(HOT_PLUG_DETECT) J5.1(HOT_PLUG_DETECT) J6.1(HOT_PLUG_DETECT) ; port XVS

Not connected (* = marked no-connect by the designer): IC1 14(SD6)* 15(SC6)* 16(SD7)* 17(SC7)*; J1 2(UTILITY)* 3(TMDS_DATA2+)* 5(TMDS_DATA2-)*; J2 2(UTILITY)* 3(TMDS_DATA2+)* 5(TMDS_DATA2-)*; J3 2(UTILITY)* 3(TMDS_DATA2+)* 5(TMDS_DATA2-)*; J4 2(UTILITY)* 3(TMDS_DATA2+)* 5(TMDS_DATA2-)*; J5 2(UTILITY)* 3(TMDS_DATA2+)* 5(TMDS_DATA2-)*; J6 2(UTILITY)* 3(TMDS_DATA2+)* 5(TMDS_DATA2-)*; M1 40(CSI4_D2_N)* 42(CSI4_D2_P)* 64(CSI4_D3_N)* 66(CSI4_D3_P)* 116(CAM0_MCLK)* 122(CAM1_MCLK)*

### Layout directives
differential pair: CSI0_CLK_N, CSI0_CLK_P, CSI0_D0_N, CSI0_D0_P, CSI0_D1_N, CSI0_D1_P, CSI1_CLK_N, CSI1_CLK_P, CSI1_D0_N, CSI1_D0_P, CSI1_D1_N, CSI1_D1_P, CSI2_CLK_N, CSI2_CLK_P, CSI2_D0_N, CSI2_D0_P, CSI2_D1_N, CSI2_D1_P, CSI3_CLK_N, CSI3_CLK_P, CSI3_D0_N, CSI3_D0_P, CSI3_D1_N, CSI3_D1_P, CSI4_CLK_N, CSI4_CLK_P, CSI4_D0_N, CSI4_D0_P, CSI4_D1_N, CSI4_D1_P, CSI5_CLK_N, CSI5_CLK_P, CSI5_D0_N, CSI5_D0_P, CSI5_D1_N, CSI5_D1_P
net class Z_95: CSI0_CLK_N, CSI0_CLK_P, CSI0_D0_N, CSI0_D0_P, CSI0_D1_N, CSI0_D1_P, CSI1_CLK_N, CSI1_CLK_P, CSI1_D0_N, CSI1_D0_P, CSI1_D1_N, CSI1_D1_P, CSI2_CLK_N, CSI2_CLK_P, CSI2_D0_N, CSI2_D0_P, CSI2_D1_N, CSI2_D1_P, CSI3_CLK_N, CSI3_CLK_P, CSI3_D0_N, CSI3_D0_P, CSI3_D1_N, CSI3_D1_P, CSI4_CLK_N, CSI4_CLK_P, CSI4_D0_N, CSI4_D0_P, CSI4_D1_N, CSI4_D1_P, CSI5_CLK_N, CSI5_CLK_P, CSI5_D0_N, CSI5_D0_P, CSI5_D1_N, CSI5_D1_P

### Notes on the sheet
- CSI CAMERA
- INTERFACE
- 0x70h
- (near IC1) 0b1110000R
- (near IC1) I2C address:
- Title
- Size:
- Date:
- A3
- Number:
- Time:
- Revision:
- Sheet
- of
- Go360.io
- (in symbol jetson-nano-new-release, part B) Pins 2, 3 and 5 differ between Pinumx and Design Guide; - done according to Design Guide

### Library data of the parts
C1-C7 = C_100n_0402: as C48 on sheet POWER; PartNumber: C_100n_0402; Value: 100n
IC1 = TCA9548A: TCA9548ARGER  I2C SWITCH W/ RESET, 8-CH, VQFN-24; Manufacturer: TEXAS INSTRUMENTS; Value: TCA9548ARGER; PartNumber: TCA9548ARGER; PartSymbol: TCA9548ARGER
J1-J6 = HDMI-0467650301
M1 = jetson-nano-new-release: PartNumber: 2309413-1; PartSymbol: 2309413-1; Value: 2309413-1
R1-R14 = R_4k7_0402: as R69 on sheet POWER; PartNumber: R_4k7_0402; Value: 4k7

## Nets that join several sheets
1V8_SYS: POWER (5 pins), WIFI_BT (C97.1 IC20.5 R102.2), NVME (R40.2)
3V3_CSI1: POWER (C62.2 IC10.4 L6.2), CSI (8 pins)
3V3_CSI2: POWER (C65.2 IC11.4 L7.2), CSI (8 pins)
3V3_CSI3: POWER (C69.2 IC14.4 L8.2), CSI (8 pins)
3V3_SYS: POWER (C49.2 C52.2 L4.2 R45.2), WIFI_BT (12 pins), NVME (14 pins), CSI (5 pins)
5V0_SYS: POWER (34 pins), SOM (F1.1 R71.2 R72.2)
GND: POWER (45 pins), SOM (88 pins), WIFI_BT (23 pins), NVME (21 pins), CSI (66 pins)
#RESET: POWER (5 pins), SOM (M1.239 RST1.2 T2.1)
#SHUTDOWN_REQ: POWER (IC12.4 R58.1), SOM (M1.233)
BT_M2_EN: SOM (M1.126), WIFI_BT (Q4.1)
BT_M2_WAKE_AP: SOM (M1.124), WIFI_BT (J15.20 R103.1)
CAM3_PWDN: SOM (M1.130), CSI (J2.15)
CAM4_PWDN: SOM (M1.216), CSI (J4.15)
CAM5_PWDN: SOM (M1.228), CSI (J6.15)
FAN_PWM: POWER (IC16.3 R68.1), SOM (M1.230)
FAN_TACH: POWER (Q1.2 R70.1), SOM (M1.208)
I2S1_LRCK: SOM (M1.224), WIFI_BT (J15.10)
I2S1_SCLK: SOM (M1.226), WIFI_BT (J15.8)
I2S1_SDIN: SOM (M1.222), WIFI_BT (J15.12)
I2S1_SDOUT: SOM (M1.220), WIFI_BT (J15.14)
M2_ALERT: SOM (M1.221), NVME (J10.44 R40.1)
PCIE0_CLK_N: SOM (M1.160), NVME (J10.53)
PCIE0_CLK_P: SOM (M1.162), NVME (J10.55)
PCIE0_RX0_N: SOM (M1.131), NVME (J10.41)
PCIE0_RX0_P: SOM (M1.133), NVME (J10.43)
PCIE0_RX1_N: SOM (M1.137), NVME (J10.29)
PCIE0_RX1_P: SOM (M1.139), NVME (J10.31)
PCIE0_RX2_N: SOM (M1.149), NVME (J10.17)
PCIE0_RX2_P: SOM (M1.151), NVME (J10.19)
PCIE0_RX3_N: SOM (M1.155), NVME (J10.5)
PCIE0_RX3_P: SOM (M1.157), NVME (J10.7)
PCIE0_TX0_N: SOM (M1.134), NVME (C40.2)
PCIE0_TX0_P: SOM (M1.136), NVME (C39.2)
PCIE0_TX1_N: SOM (M1.140), NVME (C42.2)
PCIE0_TX1_P: SOM (M1.142), NVME (C41.2)
PCIE0_TX2_N: SOM (M1.148), NVME (C44.2)
PCIE0_TX2_P: SOM (M1.150), NVME (C43.2)
PCIE0_TX3_N: SOM (M1.154), NVME (C46.2)
PCIE0_TX3_P: SOM (M1.156), NVME (C45.2)
PCIE1_CLKREQ: SOM (M1.182), WIFI_BT (J15.53)
PCIE1_RST: SOM (M1.183), WIFI_BT (J15.52)
PCIE_CLK_N: SOM (M1.173), WIFI_BT (J15.49)
PCIE_CLK_P: SOM (M1.175), WIFI_BT (J15.47)
PCIE_RX0_N: SOM (M1.167), WIFI_BT (J15.43)
PCIE_RX0_P: SOM (M1.169), WIFI_BT (J15.41)
PCIE_TX0_N: SOM (M1.172), WIFI_BT (C93.2)
PCIE_TX0_P: SOM (M1.174), WIFI_BT (C94.2)
PCIE_WAKE: SOM (M1.179), WIFI_BT (J15.55), NVME (J10.54)
PEX_L0_CLKREQ_N: SOM (M1.180), NVME (J10.52)
PEX_L0_RST_N: SOM (M1.181), NVME (J10.50)
PWR_EN: POWER (IC13.4 R62.2), SOM (M1.237)
PWR_GOOD: POWER (IC8.10 R42.2 R59.2), SOM (T3.1)
UART0_CTS: SOM (M1.105), WIFI_BT (J15.34)
UART0_RTS: SOM (M1.103), WIFI_BT (J15.36)
UART0_RXD: SOM (M1.101), WIFI_BT (J15.22)
UART0_TXD: SOM (M1.99), WIFI_BT (J15.32)
USB2_AP_N: SOM (M1.121), WIFI_BT (J15.5)
USB2_AP_P: SOM (M1.123), WIFI_BT (J15.3)
W_DISABLE1_CTRL: SOM (M1.128), WIFI_BT (Q5.1)